# EAGLE design controller (EAGLE 6.1)
DOC_ID: CLK-SCH-03; DOC_PART_NO: CLK-PC-03; DOC_REV: A; DOC_TITLE: MOTHERBOARD; PROJECT_NAME: ALARM CLOCK

## Sheet 1 of 4: CPU
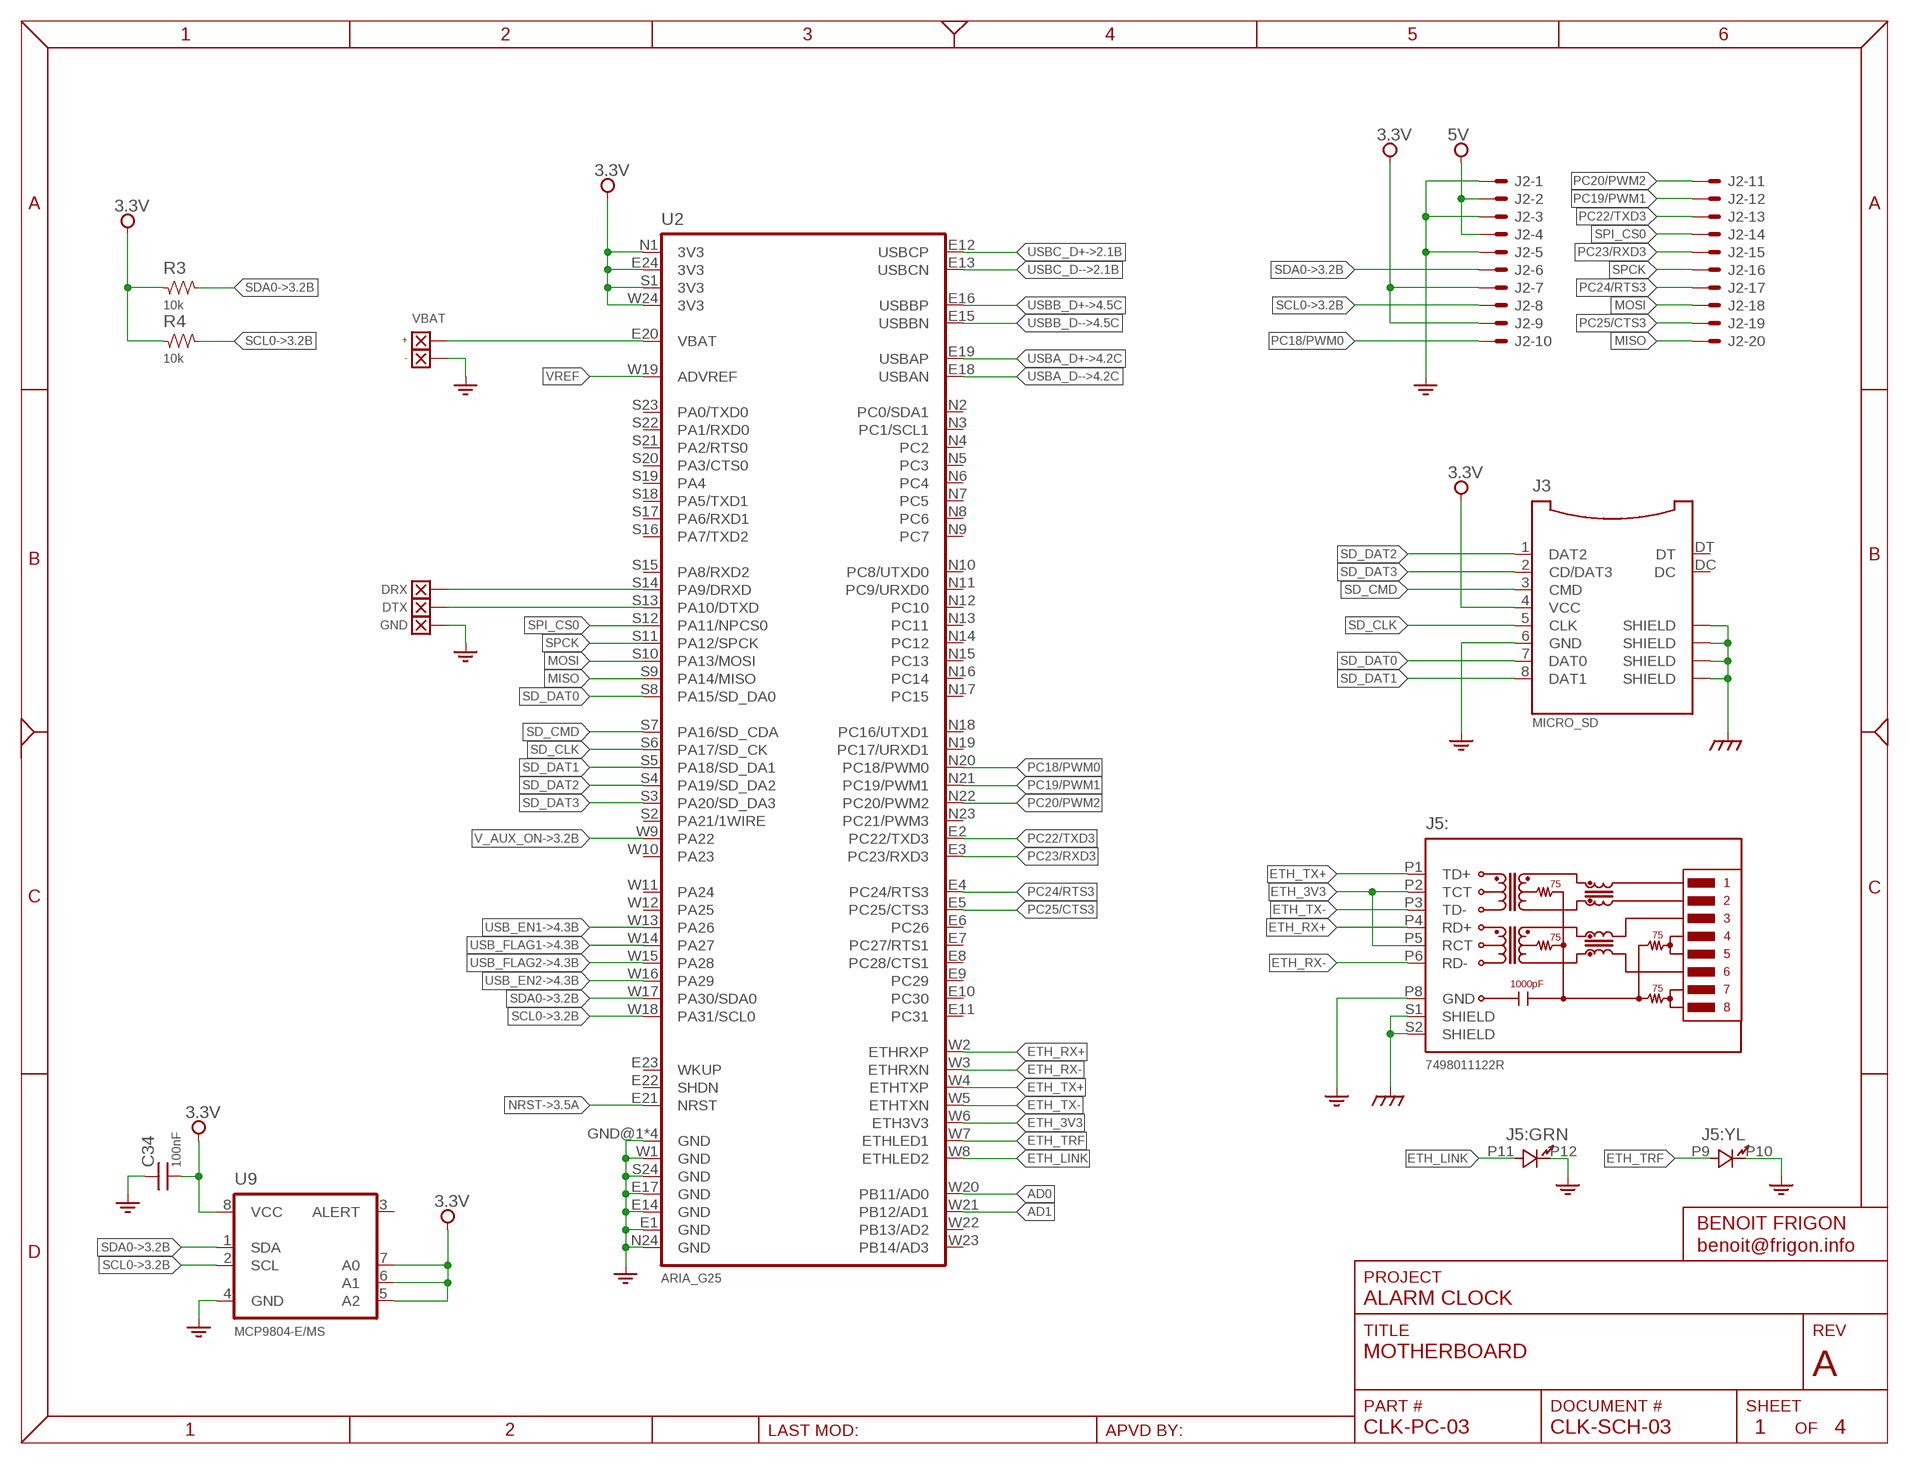
[diagram p0: schematic, sheet 1]

### Parts
C34  100nF  CAP-0603  [SMD_0603]
J2  DL-1.25MM-HEADER-20  [DF13A-20DP-1.25]
J3  MICRO_SD  [5027020891]
J5  7498011122R  [7498011122R]
R3  10k  RES-0603  [SMD_0603]
R4  10k  RES-0603  [SMD_0603]
TP1  +  WIRE-150X75  [WIRE_SMT_150X75]
TP2  -  WIRE-150X75  [WIRE_SMT_150X75]
U2  ARIA_G25  [ARIA_G25]
U9  MCP9804-E/MS  [MSOP8]
W2  DRX  WIRE-150X75  [WIRE_SMT_150X75]
W3  DTX  WIRE-150X75  [WIRE_SMT_150X75]
W4  GND  WIRE-150X75  [WIRE_SMT_150X75]

### Nets
3.3V [Power]: C34.2 J2.7 J2.9 J3.4(VCC) R3.1 R4.1 U2.E24(3V3) U2.N1(3V3) U2.S1(3V3) U2.W24(3V3) U9.5(A2) U9.6(A1) U9.7(A0) U9.8(VCC) ; also sheet 3,4
5V [Power]: J2.2 J2.4 ; also sheet 2,3,4
AD0: U2.W20(PB11/AD0)
AD1: U2.W21(PB12/AD1)
DRX: U2.S14(PA9/DRXD) W2.1
DTX: U2.S13(PA10/DTXD) W3.1
EARTH: J3.SHDL@3(SHIELD) J3.SHLD@1(SHIELD) J3.SHLD@2(SHIELD) J3.SHLD@4(SHIELD) J5.S1(::SHIELD) J5.S2(::SHIELD) ; also sheet 3,4
ETH_3V3: J5.P2(::TCT) J5.P5(::RCT) U2.W6(ETH3V3)
ETH_LINK: J5.P11(:GRN:A) U2.W8(ETHLED2)
ETH_RX+: J5.P4(::RD+) U2.W2(ETHRXP)
ETH_RX-: J5.P6(::RD-) U2.W3(ETHRXN)
ETH_TRF: J5.P9(:YL:A) U2.W7(ETHLED1)
ETH_TX+: J5.P1(::TD+) U2.W4(ETHTXP)
ETH_TX-: J5.P3(::TD-) U2.W5(ETHTXN)
GND [Power]: C34.1 J2.1 J2.3 J2.5 J3.6(GND) J5.P8(::GND) J5.P10(:YL:K) J5.P12(:GRN:K) TP2.1 U2.E1(GND) U2.E14(GND) U2.E17(GND) U2.GND@1(GND) U2.GND@2(GND) U2.GND@3(GND) U2.GND@4(GND) U2.N24(GND) U2.S24(GND) U2.W1(GND) U9.4(GND) W4.1 ; also sheet 2,3,4
MISO: J2.20 U2.S9(PA14/MISO)
MOSI: J2.18 U2.S10(PA13/MOSI)
N$1: TP1.1 U2.E20(VBAT)
NRST: U2.E21(NRST) ; also sheet 3
PC18/PWM0: J2.10 U2.N20(PC18/PWM0)
PC19/PWM1: J2.12 U2.N21(PC19/PWM1)
PC20/PWM2: J2.11 U2.N22(PC20/PWM2)
PC22/TXD3: J2.13 U2.E2(PC22/TXD3)
PC23/RXD3: J2.15 U2.E3(PC23/RXD3)
PC24/RTS3: J2.17 U2.E4(PC24/RTS3)
PC25/CTS3: J2.19 U2.E5(PC25/CTS3)
SCL0: J2.8 R4.2 U2.W18(PA31/SCL0) U9.2(SCL) ; also sheet 3
SD_CLK: J3.5(CLK) U2.S6(PA17/SD_CK)
SD_CMD: J3.3(CMD) U2.S7(PA16/SD_CDA)
SD_DAT0: J3.7(DAT0) U2.S8(PA15/SD_DA0)
SD_DAT1: J3.8(DAT1) U2.S5(PA18/SD_DA1)
SD_DAT2: J3.1(DAT2) U2.S4(PA19/SD_DA2)
SD_DAT3: J3.2(CD/DAT3) U2.S3(PA20/SD_DA3)
SDA0: J2.6 R3.2 U2.W17(PA30/SDA0) U9.1(SDA) ; also sheet 3
SPCK: J2.16 U2.S11(PA12/SPCK)
SPI_CS0: J2.14 U2.S12(PA11/NPCS0)
USB_EN1: U2.W13(PA26) ; also sheet 4
USB_EN2: U2.W16(PA29) ; also sheet 4
USB_FLAG1: U2.W14(PA27) ; also sheet 4
USB_FLAG2: U2.W15(PA28) ; also sheet 4
USBA_D+: U2.E19(USBAP) ; also sheet 4
USBA_D-: U2.E18(USBAN) ; also sheet 4
USBB_D+: U2.E16(USBBP) ; also sheet 4
USBB_D-: U2.E15(USBBN) ; also sheet 4
USBC_D+: U2.E12(USBCP) ; also sheet 2
USBC_D-: U2.E13(USBCN) ; also sheet 2
V_AUX_ON: U2.W9(PA22) ; also sheet 3
VREF: U2.W19(ADVREF)
Unconnected: J3.DC J3.DT U2.E6(PC26) U2.E7(PC27/RTS1) U2.E8(PC28/CTS1) U2.E9(PC29) U2.E10(PC30) U2.E11(PC31) U2.E22(SHDN) U2.E23(WKUP) U2.N2(PC0/SDA1) U2.N3(PC1/SCL1) U2.N4(PC2) U2.N5(PC3) U2.N6(PC4) U2.N7(PC5) U2.N8(PC6) U2.N9(PC7) U2.N10(PC8/UTXD0) U2.N11(PC9/URXD0) U2.N12(PC10) U2.N13(PC11) U2.N14(PC12) U2.N15(PC13) U2.N16(PC14) U2.N17(PC15) U2.N18(PC16/UTXD1) U2.N19(PC17/URXD1) U2.N23(PC21/PWM3) U2.S2(PA21/1WIRE) U2.S15(PA8/RXD2) U2.S16(PA7/TXD2) U2.S17(PA6/RXD1) U2.S18(PA5/TXD1) U2.S19(PA4) U2.S20(PA3/CTS0) U2.S21(PA2/RTS0) U2.S22(PA1/RXD0) U2.S23(PA0/TXD0) U2.W10(PA23) U2.W11(PA24) U2.W12(PA25) U2.W22(PB13/AD2) U2.W23(PB14/AD3) U9.3(ALERT)

### Notes on the sheet
- VBAT

## Sheet 2 of 4: Audio
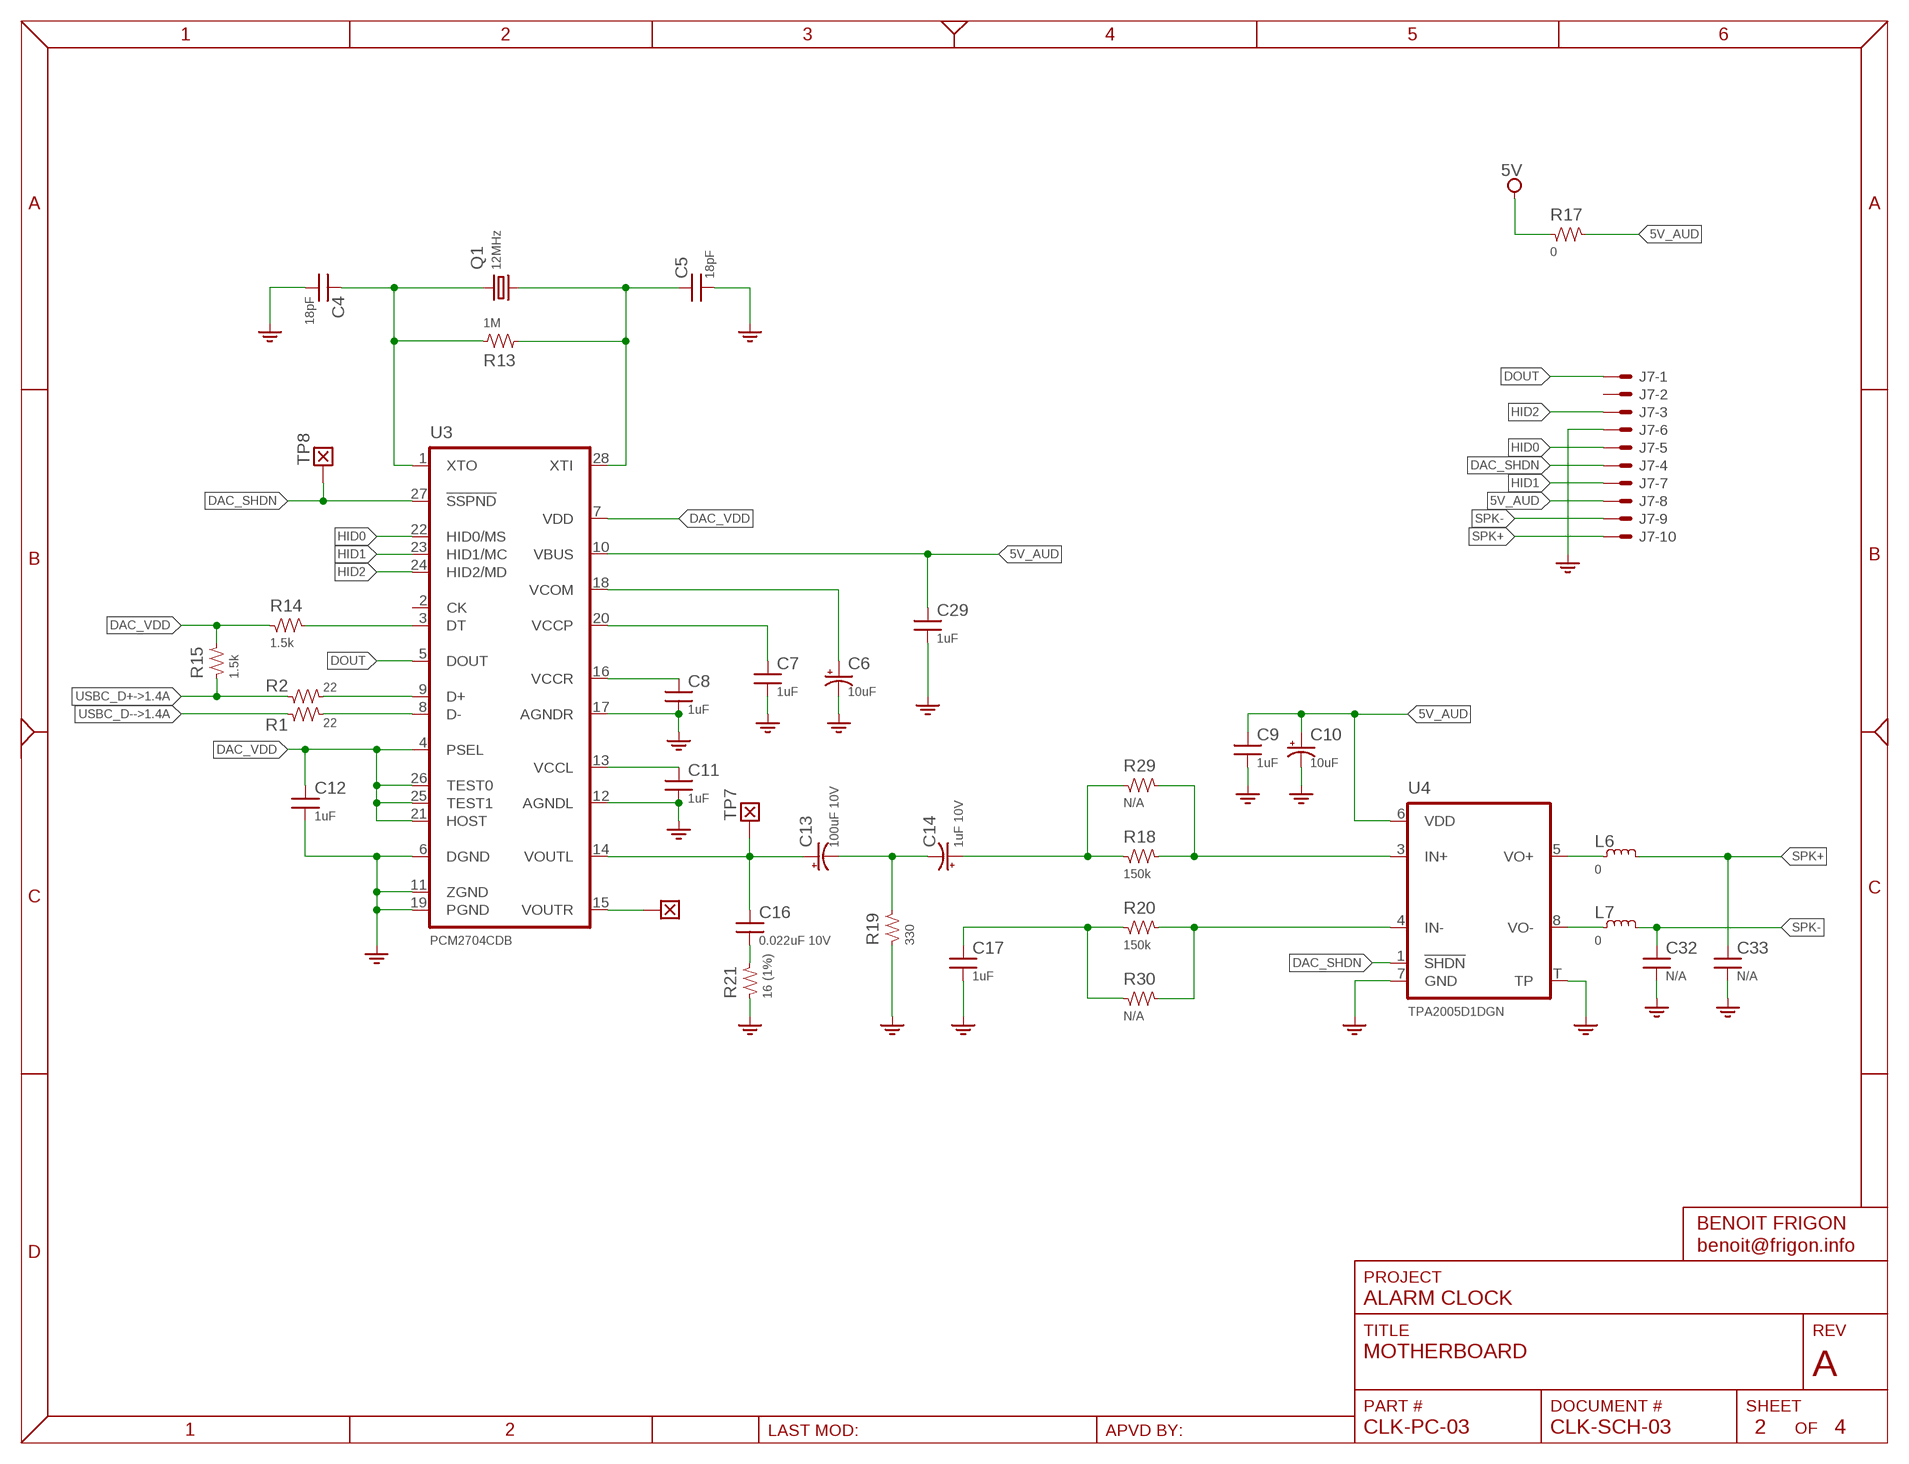
[diagram p1: schematic, sheet 2]
FRAME2 (FRAME_LETTER): SUBTITLE: AUDIO

### Parts
C4  18pF  CAP-0603  [SMD_0603]
C5  18pF  CAP-0603  [SMD_0603]
C6  10uF  CAP-E-0805-ALUM  [CAP_S0805]
C7  1uF  CAP-0603  [SMD_0603]
C8  1uF  CAP-0603  [SMD_0603]
C9  1uF  CAP-0603  [SMD_0603]
C10  10uF  CAP-E-0805-ALUM  [CAP_S0805]
C11  1uF  CAP-0603  [SMD_0603]
C12  1uF  CAP-0603  [SMD_0603]
C13  100uF 10V  CAP-E-1210-ALUM  [CAP_S1210]
C14  1uF 10V  CAP-E-0805-ALUM  [CAP_S0805]
C16  0.022uF 10V  CAP-0603  [SMD_0603]
C17  1uF  CAP-0603  [SMD_0603]
C29  1uF  CAP-0603  [SMD_0603]
C32  N/A  CAP-0603  [SMD_0603]
C33  N/A  CAP-0603  [SMD_0603]
J7  DL-1.25MM-HEADER-10  [DF13A-10DP-1.25]
L6  0  IND-0603  [SMD_0603]
L7  0  IND-0603  [SMD_0603]
Q1  12MHz  XTALHC49UP  [HC49UP]
R1  22  RES-0603  [SMD_0603]
R2  22  RES-0603  [SMD_0603]
R13  1M  RES-0603  [SMD_0603]
R14  1.5k  RES-0603  [SMD_0603]
R15  1.5k  RES-0603  [SMD_0603]
R17  0  RES-1206  [SMD_1206]
R18  150k  RES-0603  [SMD_0603]
R19  330  RES-0603  [SMD_0603]
R20  150k  RES-0603  [SMD_0603]
R21  16 (1%)  RES-0603  [SMD_0603]
R29  N/A  RES-0603  [SMD_0603]
R30  N/A  RES-0603  [SMD_0603]
TP7  TEST_POINT-050  [TP_050]
TP8  TEST_POINT-050  [TP_050]
U3  PCM2704CDB  [SSOP28]
U4  TPA2005D1DGN  [PPSOP8]
W1  WIRE-150X75  [WIRE_SMT_150X75]

### Nets
5V [Power]: R17.1 ; also sheet 1,3,4
5V_AUD [Power]: C9.1 C10.+ C29.1 J7.8 R17.2 U3.10(VBUS) U4.6(VDD)
DAC_SHDN: J7.4 TP8.1 U3.27(!SSPND) U4.1(!SHDN)
DAC_VDD: C12.1 R14.1 R15.2 U3.4(PSEL) U3.7(VDD) U3.21(HOST) U3.25(TEST1) U3.26(TEST0)
DOUT: J7.1 U3.5(DOUT)
GND [Power]: C4.2 C5.2 C6.- C7.2 C8.2 C9.2 C10.- C11.2 C12.2 C17.2 C29.2 C32.2 C33.2 J7.6 R19.1 R21.1 U3.6(DGND) U3.11(ZGND) U3.12(AGNDL) U3.17(AGNDR) U3.19(PGND) U4.7(GND) U4.T(TP) ; also sheet 1,3,4
HID0: J7.5 U3.22(HID0/MS)
HID1: J7.7 U3.23(HID1/MC)
HID2: J7.3 U3.24(HID2/MD)
N$12: R2.2 U3.9(D+)
N$13: R1.2 U3.8(D-)
N$14: C11.1 U3.13(VCCL)
N$15: C6.+ U3.18(VCOM)
N$16: C7.1 U3.20(VCCP)
N$17: C8.1 U3.16(VCCR)
N$18: C14.+ R18.1 R29.1
N$19: R14.2 U3.3(DT)
N$20: U3.15(VOUTR) W1.1
N$24: L6.1 U4.5(VO+)
N$25: L7.1 U4.8(VO-)
N$26: R18.2 R29.2 U4.3(IN+)
N$27: R20.2 R30.2 U4.4(IN-)
N$28: C17.1 R20.1 R30.1
N$29: C13.- C14.- R19.2
N$31: C16.2 R21.2
SPK+: C33.1 J7.10 L6.2
SPK-: C32.1 J7.9 L7.2
USBC_D+: R2.1 R15.1 ; also sheet 1
USBC_D-: R1.1 ; also sheet 1
VOUTL: C13.+ C16.1 TP7.1 U3.14(VOUTL)
XTI: C5.1 Q1.2 R13.2 U3.28(XTI)
XTO: C4.1 Q1.1 R13.1 U3.1(XTO)
Unconnected: J7.2 U3.2(CK)

## Sheet 3 of 4: Power supply
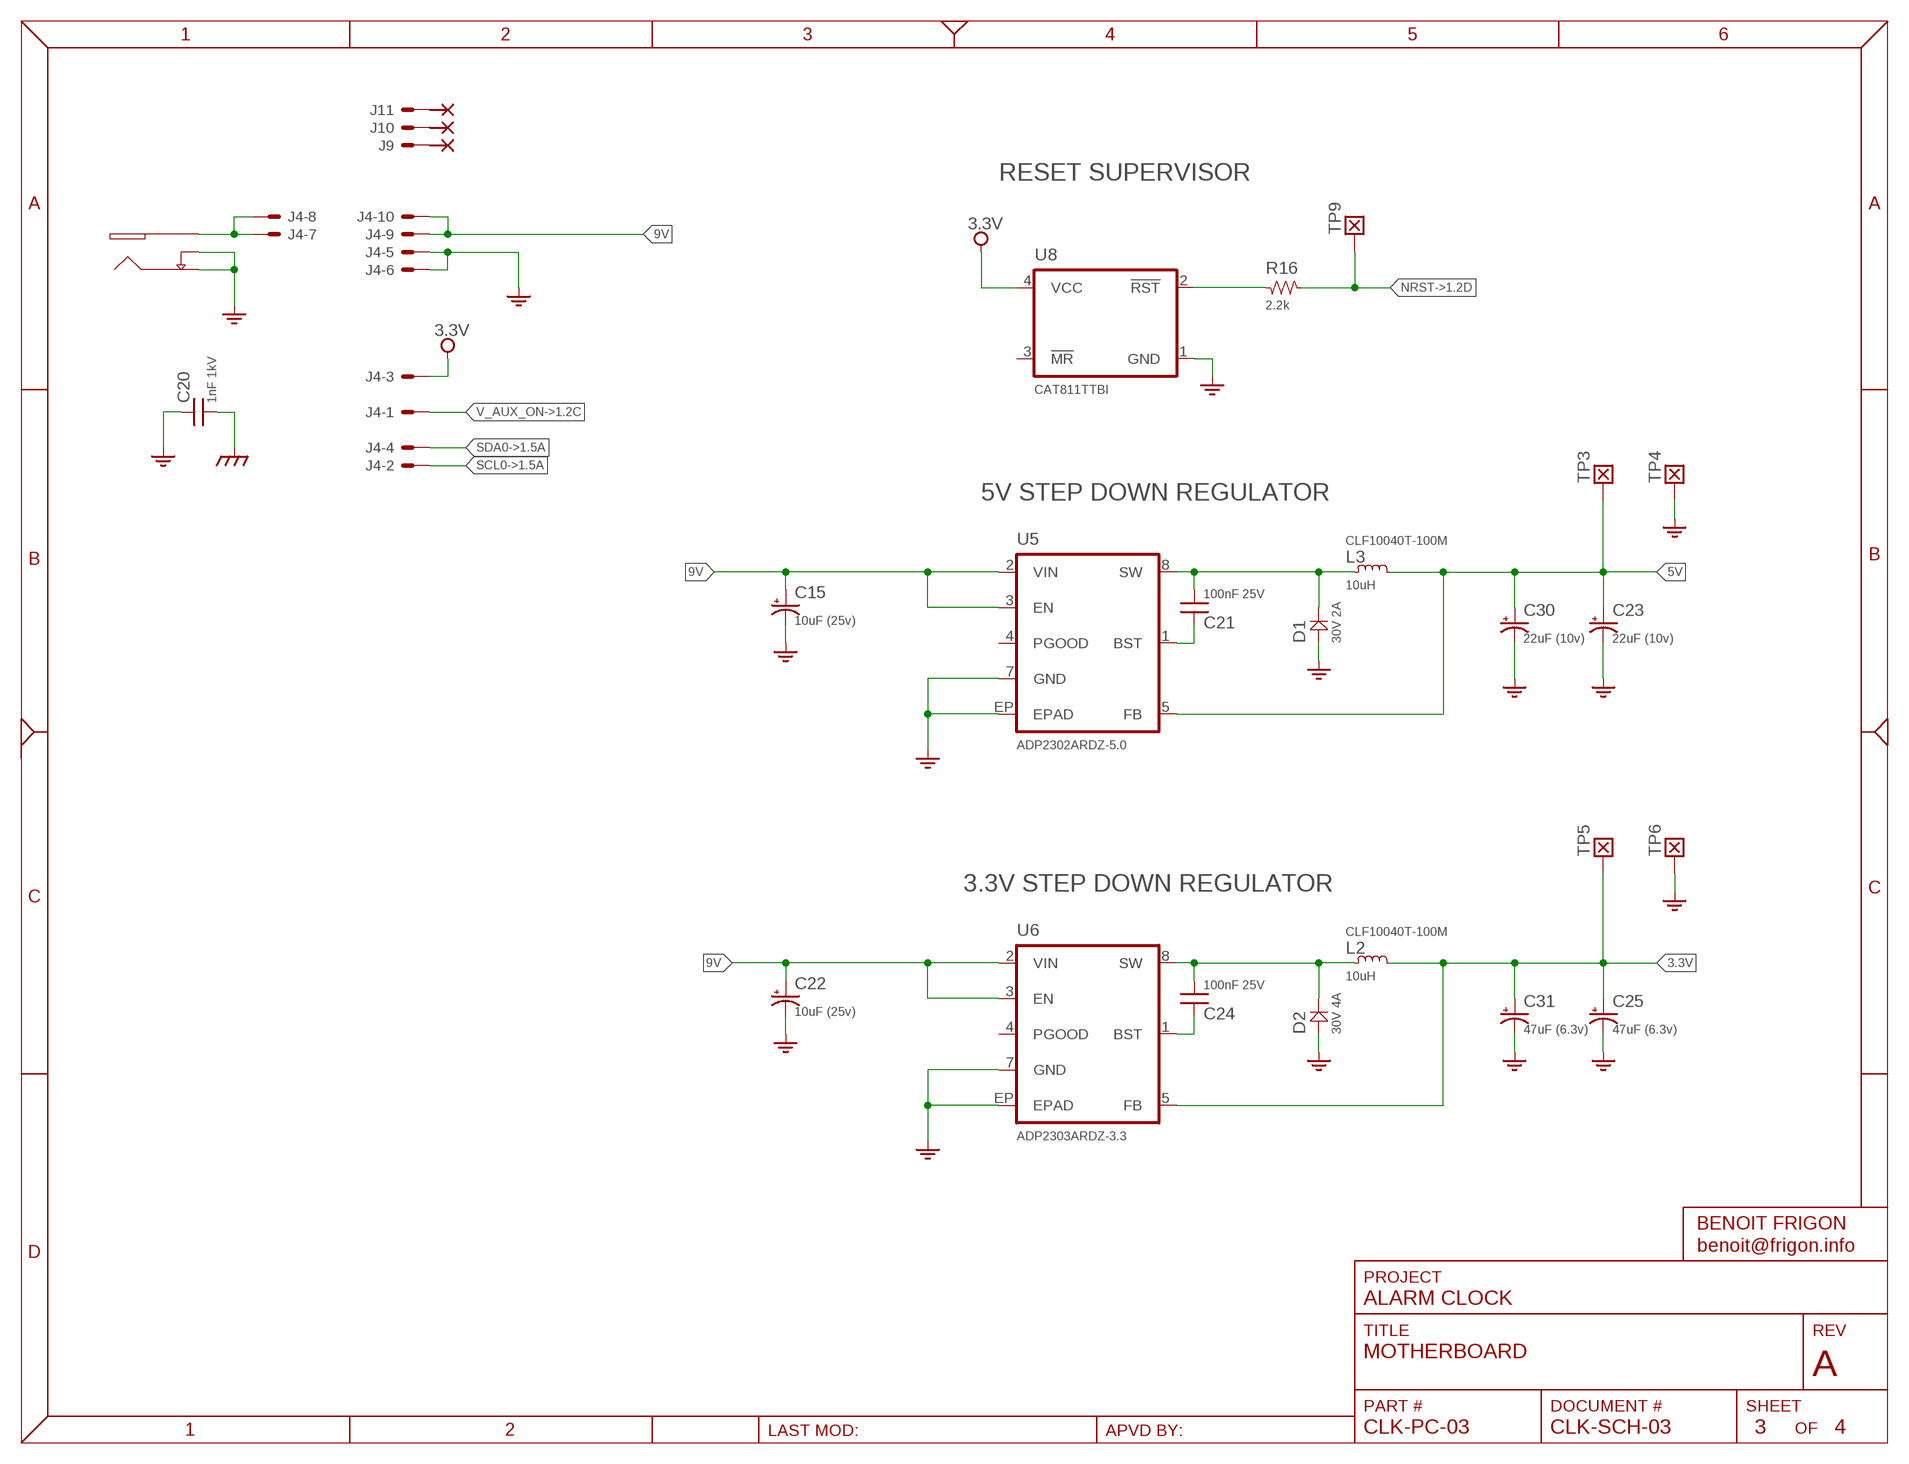
[diagram p2: schematic, sheet 3]
FRAME3 (FRAME_LETTER): SUBTITLE: POWER SUPPLY

### Parts
C15  10uF (25v)  CAP-E-1210-TANT  [CAP_S1210]
C20  1nF 1kV  CAP-0805  [SMD_0805]
C21  100nF 25V  CAP-0603  [SMD_0603]
C22  10uF (25v)  CAP-E-1210-TANT  [CAP_S1210]
C23  22uF (10v)  CAP-E-1206-TANT  [CAP_S1206]
C24  100nF 25V  CAP-0603  [SMD_0603]
C25  47uF (6.3v)  CAP-E-1206-TANT  [CAP_S1206]
C30  22uF (10v)  CAP-E-1206-TANT  [CAP_S1206]
C31  47uF (6.3v)  CAP-E-1206-TANT  [CAP_S1206]
D1  30V 2A  DIODE-DO214-AA  [DIODE_DO214-AA]
D2  30V 4A  DIODE-DO214-AA  [DIODE_DO214-AA]
J4  DL-100-HEADER-10-V  [534206-5]
J8  CUI-PJ-013C  [CUI-PJ-013C]
J9  SNG-100-HEADER-01-HDR-V  [HDR_M_1]
J10  SNG-100-HEADER-01-HDR-V  [HDR_M_1]
J11  SNG-100-HEADER-01-HDR-V  [HDR_M_1]
L2  10uH  IND-10X10  [IND-10X10]
L3  10uH  IND-10X10  [IND-10X10]
R16  2.2k  RES-0603  [SMD_0603]
TP3  TEST_POINT-050  [TP_050]
TP4  TEST_POINT-050  [TP_050]
TP5  TEST_POINT-050  [TP_050]
TP6  TEST_POINT-050  [TP_050]
TP9  TEST_POINT-050  [TP_050]
U5  ADP2302ARDZ-5.0  [SOIC8-EP]
U6  ADP2303ARDZ-3.3  [SOIC8-EP]
U8  CAT811TTBI  [SOT143]

### Nets
3.3V [Power]: C25.+ C31.+ J4.3 L2.2 TP5.1 U6.5(FB) U8.4(VCC) ; also sheet 1,4
5V [Power]: C23.+ C30.+ L3.2 TP3.1 U5.5(FB) ; also sheet 1,2,4
9V [Power]: C15.+ C22.+ J4.9 J4.10 U5.2(VIN) U5.3(EN) U6.2(VIN) U6.3(EN)
BST_3.3V: C24.1 U6.1(BST)
BST_5V: C21.1 U5.1(BST)
EARTH: C20.2 ; also sheet 1,4
GND [Power]: C15.- C20.1 C22.- C23.- C25.- C30.- C31.- D1.A D2.A J4.5 J4.6 J8.2(GND) J8.3(SW) TP4.1 TP6.1 U5.7(GND) U5.EP(EPAD) U6.7(GND) U6.EP(EPAD) U8.1(GND) ; also sheet 1,2,4
N$21: R16.1 U8.2(!RST)
N$23: J4.7 J4.8 J8.1(V+)
NRST: R16.2 TP9.1 ; also sheet 1
SCL0: J4.2 ; also sheet 1
SDA0: J4.4 ; also sheet 1
SW_3.3: C24.2 D2.K L2.1 U6.8(SW)
SW_5V: C21.2 D1.K L3.1 U5.8(SW)
V_AUX_ON: J4.1 ; also sheet 1
Unconnected: J9.1(S) J10.1(S) J11.1(S) U5.4(PGOOD) U6.4(PGOOD) U8.3(!MR)

### Notes on the sheet
- RESET SUPERVISOR
- 5V STEP DOWN REGULATOR
- 3.3V STEP DOWN REGULATOR

## Sheet 4 of 4: USB
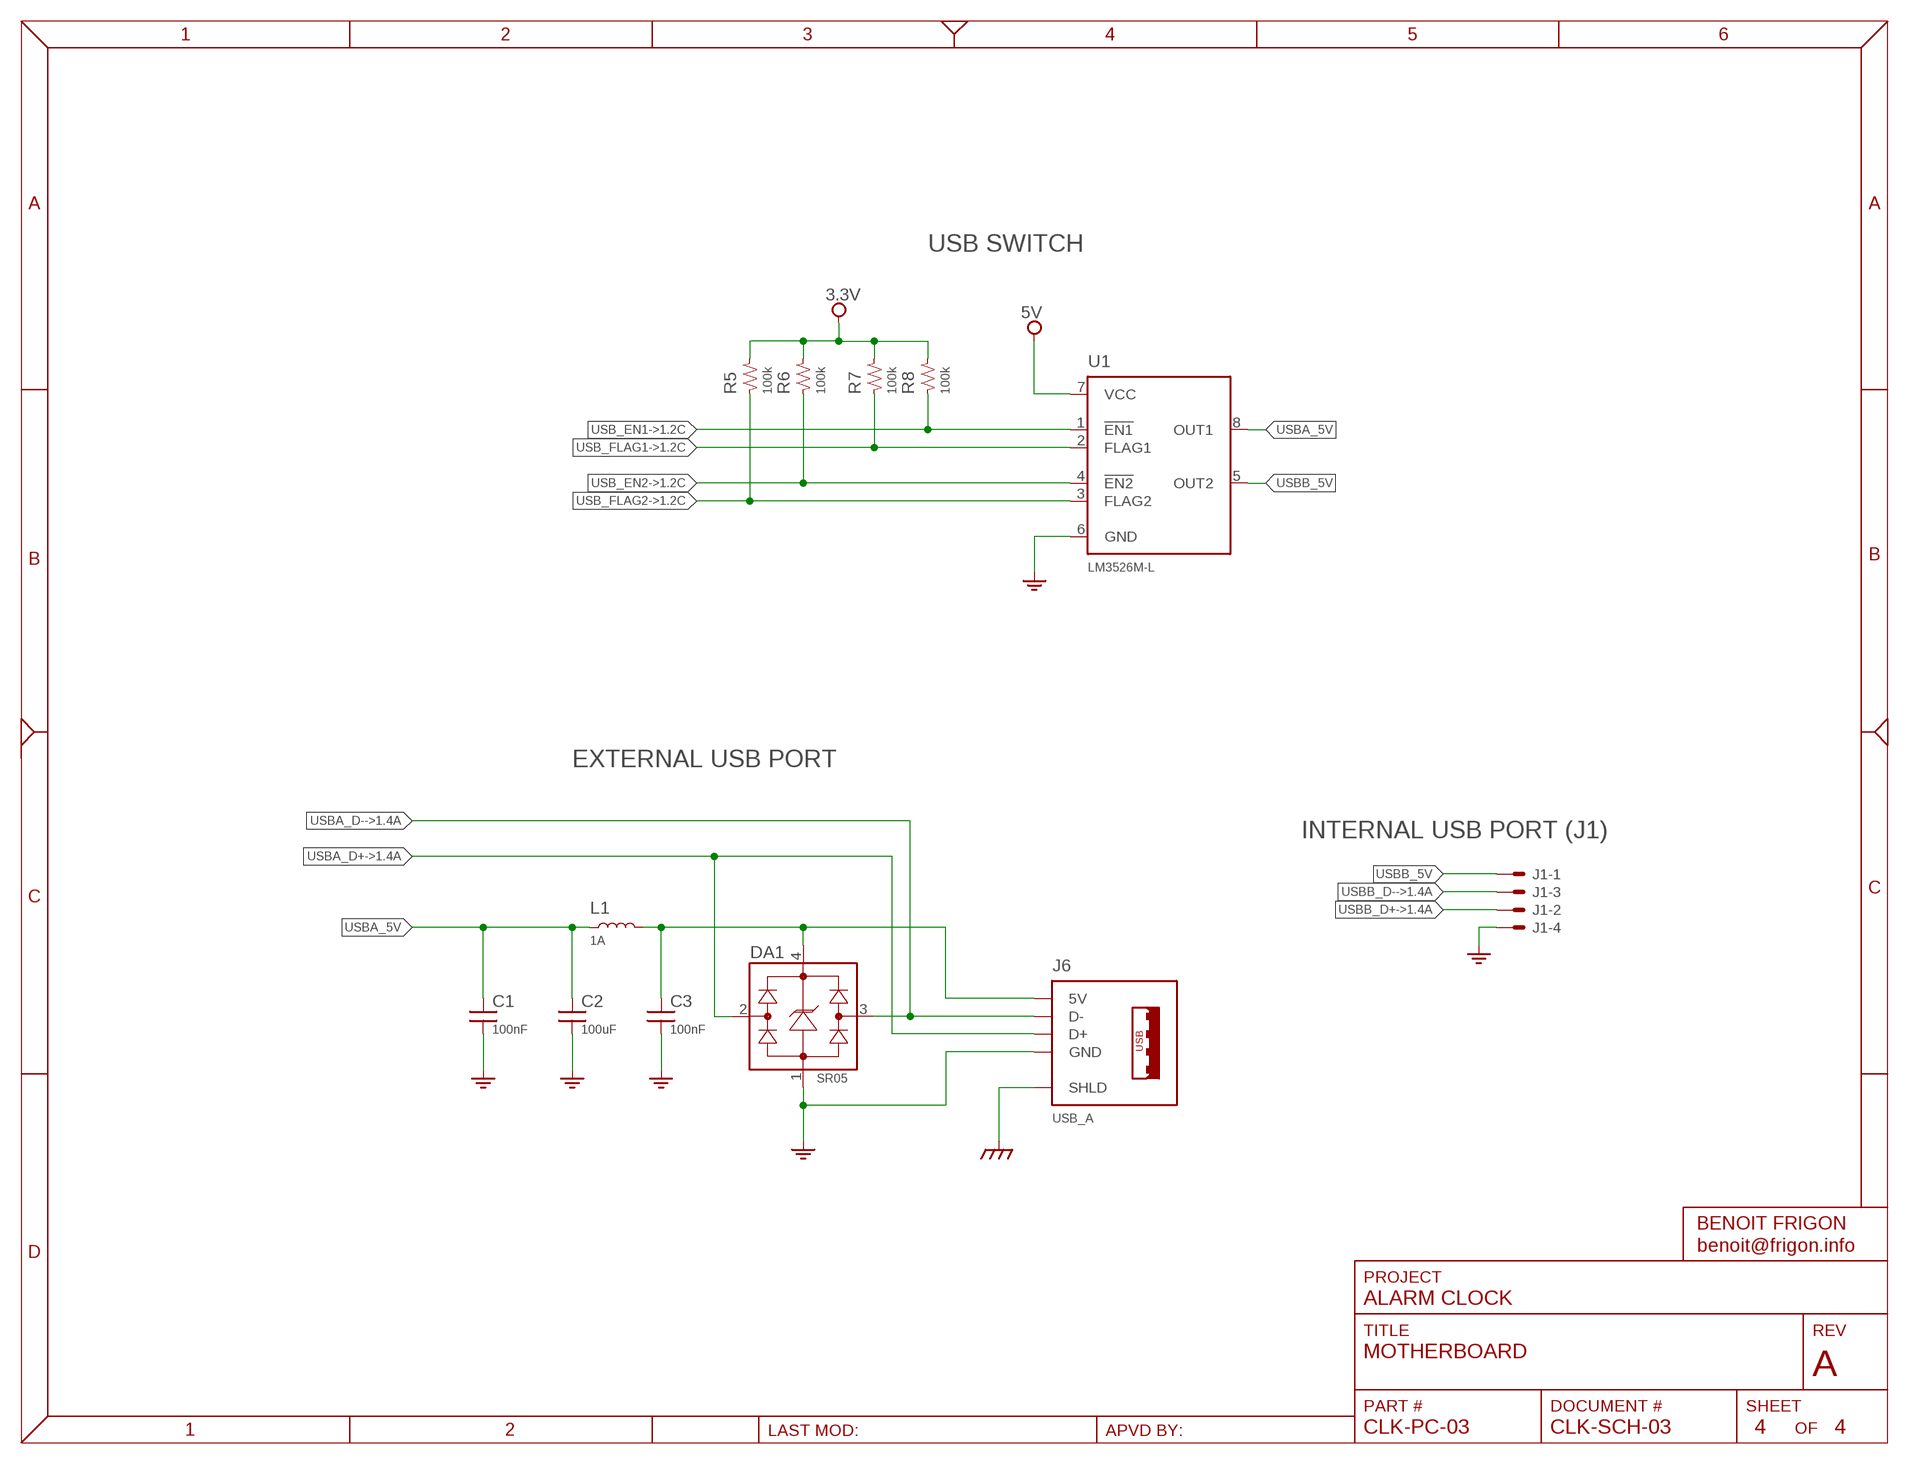
[diagram p3: schematic, sheet 4]

### Parts
C1  100nF  CAP-0603  [SMD_0603]
C2  100uF  CAP-0805  [SMD_0805]
C3  100nF  CAP-0603  [SMD_0603]
DA1  SR05  [SOT143]
J1  SNG-2MM-HEADER-04-V  [DF3X-4P-2DSA]
J6  USB_A  [292303-1]
L1  1A  FERRITE  [SMD_0805]
R5  100k  RES-0603  [SMD_0603]
R6  100k  RES-0603  [SMD_0603]
R7  100k  RES-0603  [SMD_0603]
R8  100k  RES-0603  [SMD_0603]
U1  LM3526M-L  [SOIC8]

### Nets
3.3V [Power]: R5.2 R6.2 R7.2 R8.2 ; also sheet 1,3
5V [Power]: U1.7(VCC) ; also sheet 1,2,3
EARTH: J6.SHLD@1(SHLD) J6.SHLD@2(SHLD) ; also sheet 1,3
GND [Power]: C1.2 C2.2 C3.2 DA1.1 J1.4 J6.4(GND) U1.6(GND) ; also sheet 1,2,3
N$5: C3.1 DA1.4 J6.1(5V) L1.2
USB_EN1: R8.1 U1.1(!EN1) ; also sheet 1
USB_EN2: R6.1 U1.4(!EN2) ; also sheet 1
USB_FLAG1: R7.1 U1.2(FLAG1) ; also sheet 1
USB_FLAG2: R5.1 U1.3(FLAG2) ; also sheet 1
USBA_5V: C1.1 C2.1 L1.1 U1.8(OUT1)
USBA_D+: DA1.2 J6.3(D+) ; also sheet 1
USBA_D-: DA1.3 J6.2(D-) ; also sheet 1
USBB_5V: J1.1 U1.5(OUT2)
USBB_D+: J1.2 ; also sheet 1
USBB_D-: J1.3 ; also sheet 1

### Notes on the sheet
- USB SWITCH
- EXTERNAL USB PORT
- INTERNAL USB PORT (J1)

## Library data of the parts
C1 C3-C5 C7-C9 C11 C12 C16 C17 C21 C24 C29 C32-C34 = Passive:CAP: Capacitor; DESCRIPTION: {DESCRIPTION} - SMT 0603 - {value}; PACKAGE: SMT 0603
C2 C20 = Passive:CAP: Capacitor; DESCRIPTION: {DESCRIPTION} - SMT 0805 - {value}; PACKAGE: SMT 0805
C6 C10 C14 = Passive:CAP-E-?-*: Capacitor; DESCRIPTION: Aluminium capacitor - SMT 0805 - {VALUE}
C13 = Passive:CAP-E-?-*: Capacitor; DESCRIPTION: Aluminium capacitor - SMT 1210 - {VALUE}; MFG: AVX
C15 C22 = Passive:CAP-E-?-*: Capacitor; DESCRIPTION: Tantalum capacitor - SMT 1210 - {VALUE}; MFG: AVX; PART_NO: TPSB106K025R1800
C23 C30 = Passive:CAP-E-?-*: Capacitor; DESCRIPTION: Tantalum capacitor - SMT 1206 - {VALUE}; MFG: AVX; PART_NO: TPSA226M010R0900
C25 C31 = Passive:CAP-E-?-*: Capacitor; DESCRIPTION: Tantalum capacitor - SMT 1206 - {VALUE}; MFG: AVX; PART_NO: TPSA476K006R0800
D1 D2 = Passive:DIODE: Diode
DA1 = Passive:SR05: TVS Array 2-Line - 5V; MFG: Semtech; SKU: SR05.TCT
J1 = Connectors:SNG-2MM-HEADER-04: 2mm Single Row Header - 4 pos; DESCRIPTION: {DESCRIPTION} - Vertical; MFG: Hirose Electronic; SKU: DF3A-4P-2DSA
J2 = Connectors:DL-1.25MM-HEADER-20
J3 = Connectors:MICRO_SD
J4 = Connectors:DL-100-HEADER-10: 10 Pos - Dual Row - 2.54mm; DESCRIPTION: {DESCRIPTION} Receptacle - Vertical; MFG: Tyco Electronics; SKU: 534206-5
J5 = Connectors:7498011122R
J6 = Connectors:USB_A
J7 = Connectors:DL-1.25MM-HEADER-10
J8 = Connectors:CUI-PJ-013C
J9-J11 = Connectors:SNG-100-HEADER-01: 1 Pos - 2.54mm header
L1 = Passive:FERRITE: Ferrite; DESCRIPTION: {DESCRIPTION} - SMT 0805 - {VALUE}
L2 = Passive:IND?*: Inductor; DESCRIPTION: {DESCRIPTION} - SMT 10x10mm - {VALUE}; PART_NO: CLF10040T-100M
L3 = Passive:IND?*: Inductor; DESCRIPTION: {DESCRIPTION} - SMT 10x10mm - {VALUE}; MFG: TDK; PART_NO: CLF10040T-100M
L6 L7 = Passive:IND?*: Inductor; DESCRIPTION: {DESCRIPTION} - SMT 0603 - {VALUE}
Q1 = Crystal:XTAL: Crystal
R1-R8 R13-R16 R18-R21 R29 R30 = Passive:RES: Resistor; DESCRIPTION: {DESCRIPTION} - SMT 0603 - {VALUE}; PACKAGE: SMT 0603
R17 = Passive:RES: Resistor; DESCRIPTION: {DESCRIPTION} - SMT 1206 - {VALUE}; PACKAGE: SMT 1206
TP1 TP2 W1-W4 = Misc:WIRE-?: Wire solder pad; BOM: FALSE
TP3-TP9 = Misc:TEST_POINT; BOM: FALSE
U1 = Power:LM3526?-*: Dual Port USB Power Switch and Over-Current Protection Features Compatible with USB1.1 and USB 2.0 1 ms fault flag delay filters Hot-Plug events Smooth turn-on eliminates in-rush induced voltage drop UL recognized component: REF# 205202 1A nominal short circuit output current protects PC power supplies Thermal shutdown protects device in direct short condition 500mA minimum continuous load current Small SO-8 package minimizes board space 2.7V to 5.5V input voltage range 140 m? Max. switch resistance 1 ?A Max. standby current 200 ?A Max. operating current Under-voltage lockout (UVLO); DESCRIPTION: Dual Port USB Power Switch and Over-Current Protection (Active Low); MFG: National Semiconductors
U2 = IC:ARIA_G25: ARM SoM 400MHz
U3 = IC:PCM2704C
U4 = IC:TPA2005D1?
U5 = Power:ADP230?: Step-Down Regulator; DESCRIPTION: {DESCRIPTION} - 2A, 5V; MFG: Analog Devices
U6 = Power:ADP230?: Step-Down Regulator; DESCRIPTION: {DESCRIPTION} - 3A, 3.3v; MFG: Analog Devices
U8 = IC:CAT811*?: Microprocessor power supply supervisor; DESCRIPTION: {DESCRIPTION} - 3.08V threshold; MFG: ON Semiconductors; THRESHOLD: 3.08V
U9 = IC:MCP9804-*/?: ±0.25°C Typical Accuracy Digital Temperature Sensor; MFG: Microchip

## Net classes
1 Power: width 0.305 mm, drill 0.508 mm

## Board
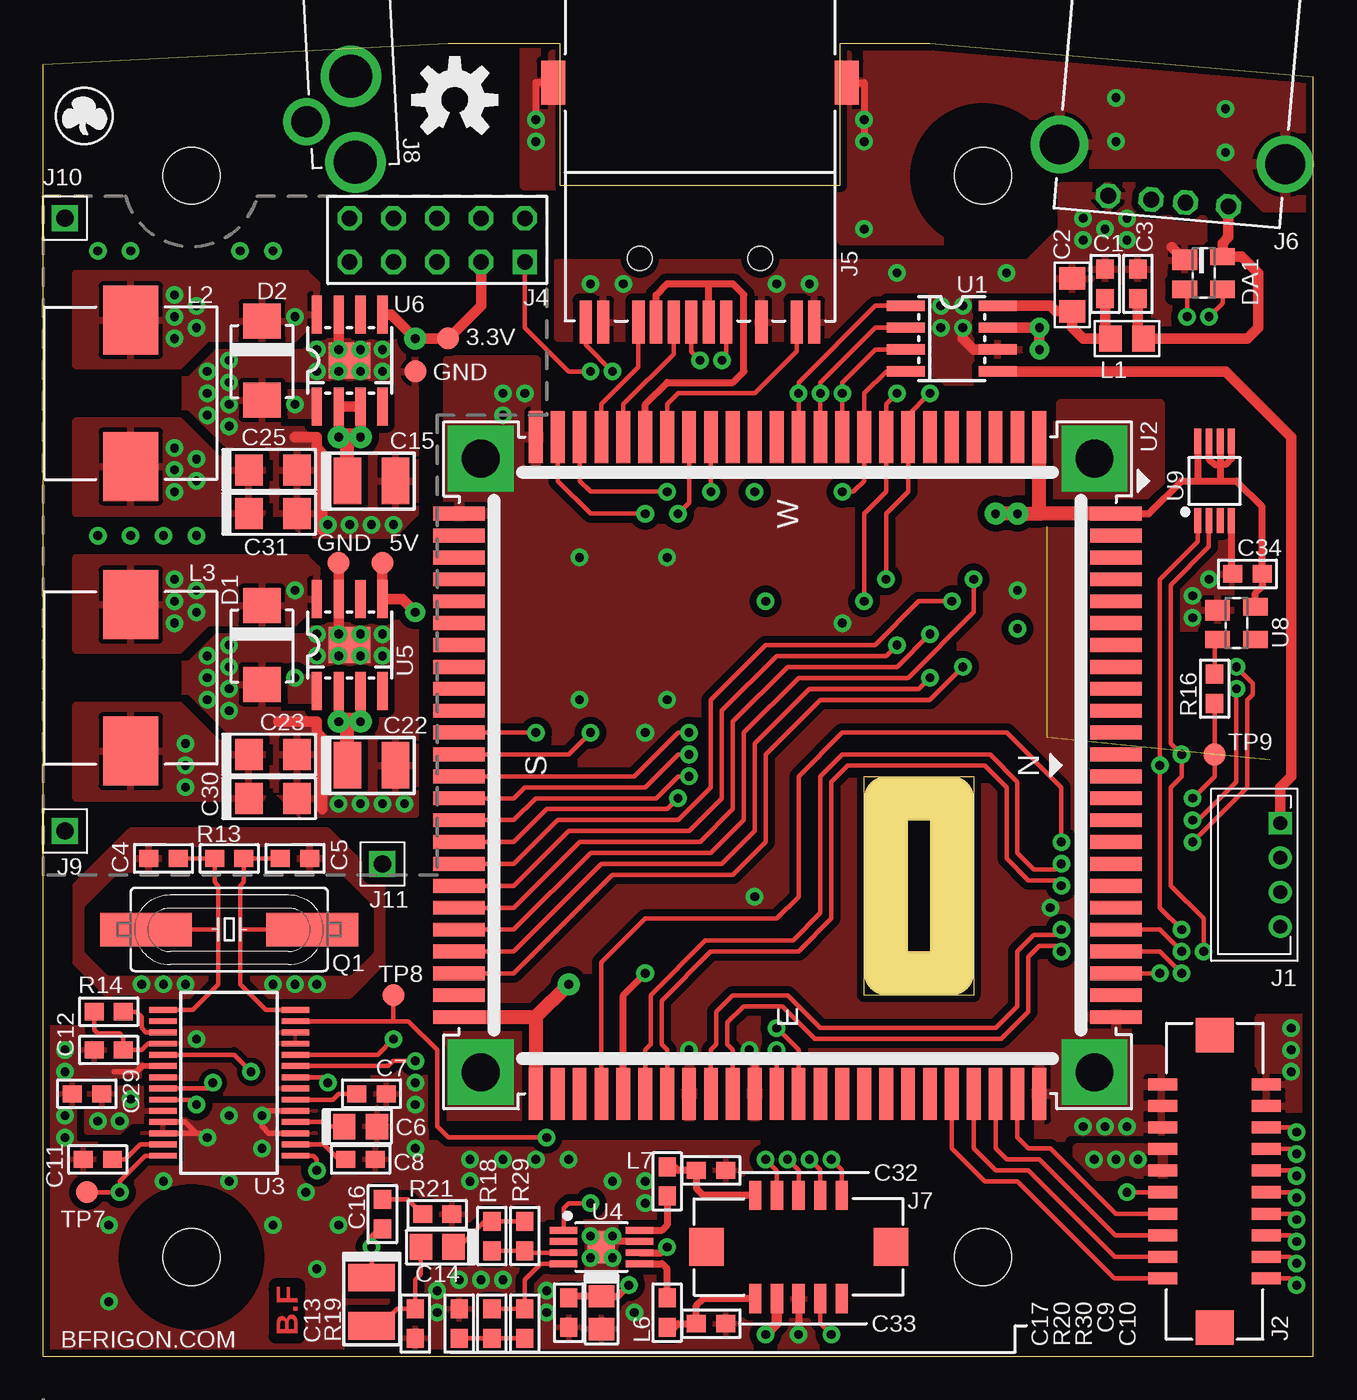
[diagram p4: board, top side]
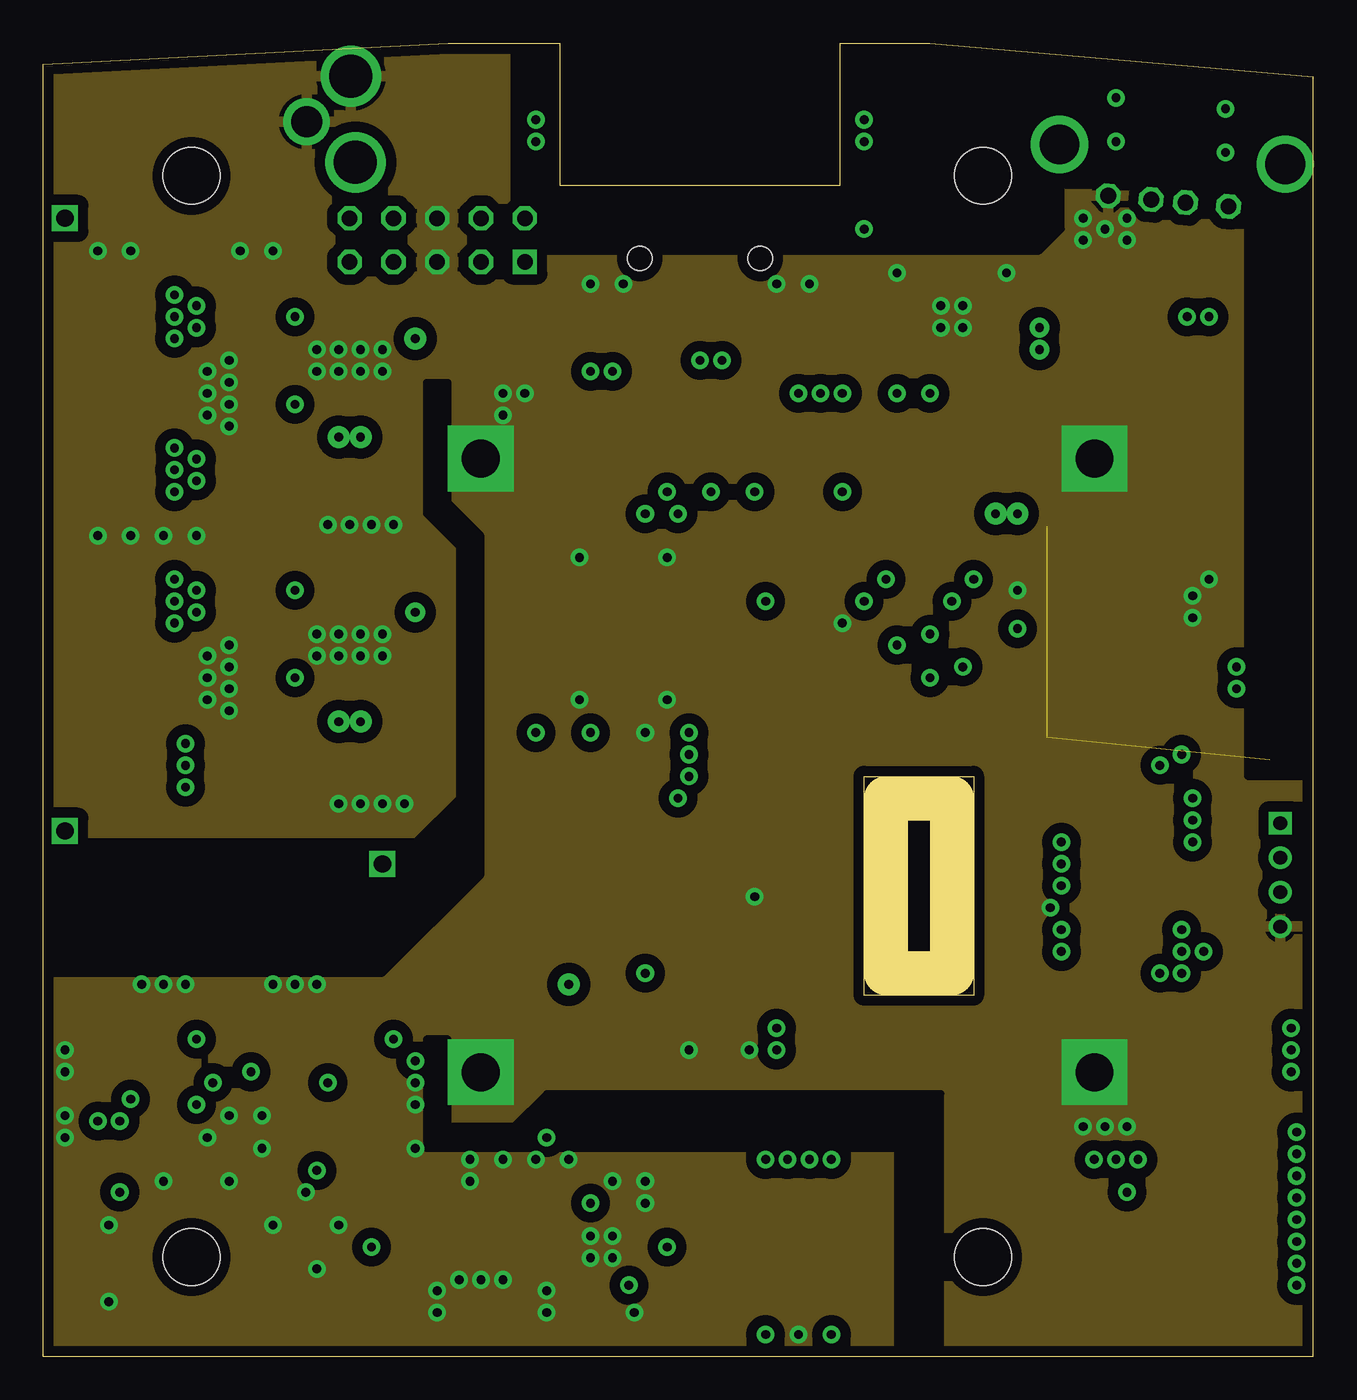
[diagram p5: board, inner layer GND]
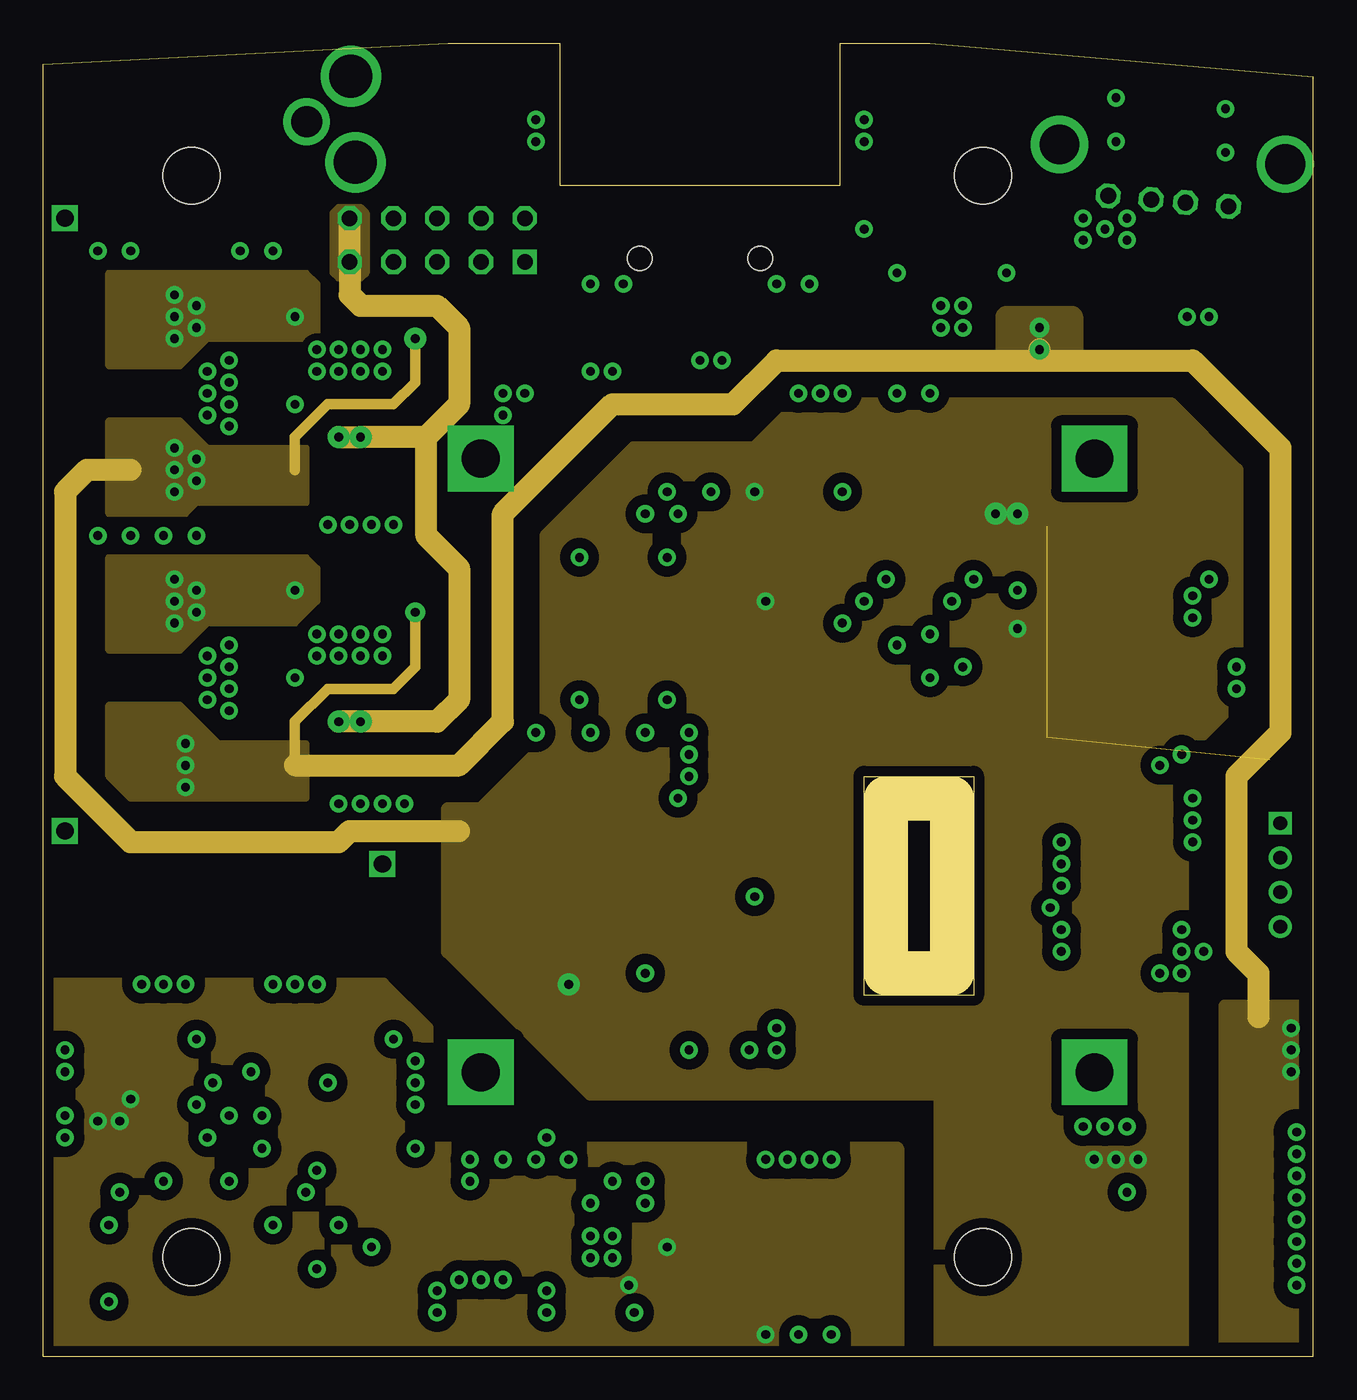
[diagram p6: board, inner layer Power]
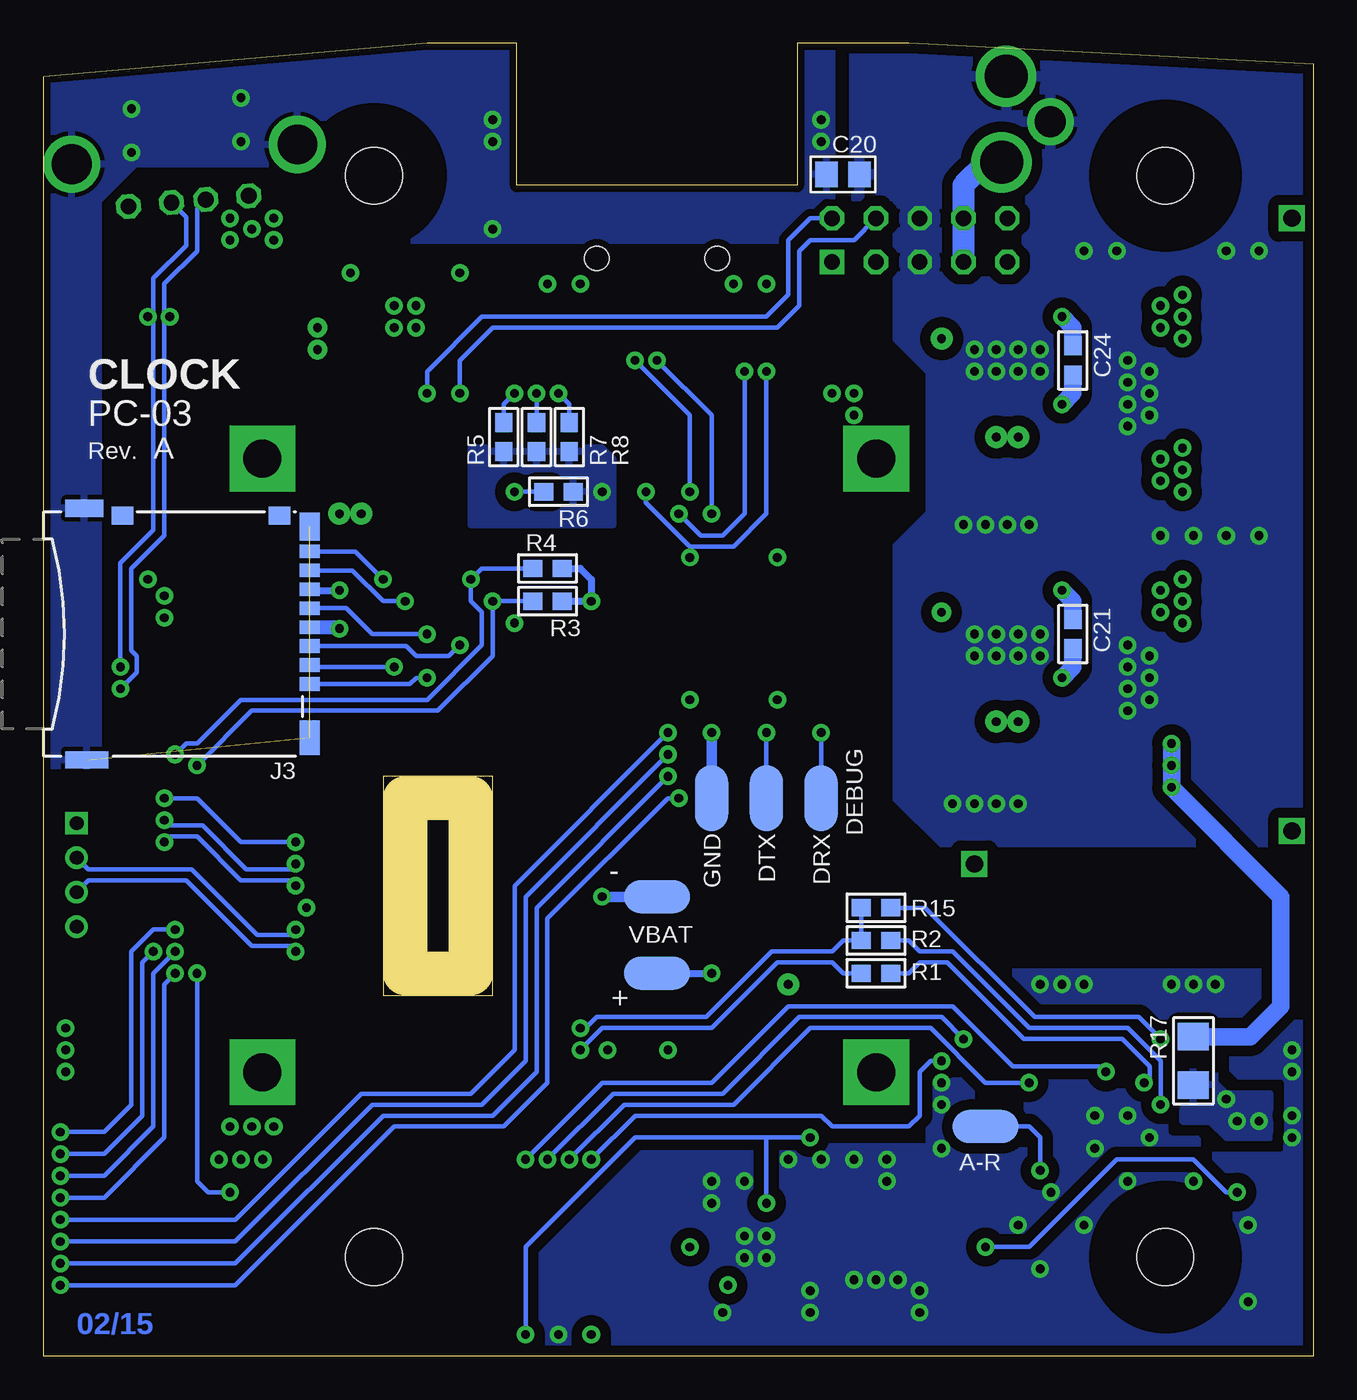
[diagram p7: board, bottom side, seen from below]

Size 73.66 x 76.2 mm. Coordinates in mm from the lower left corner, seen from the top.
Outline: 0,0 73.66,0 73.66,74.24 51.44,76.2 46.23,76.2 46.23,67.94 29.97,67.94 29.97,76.2 23.5,76.2 0,74.98 0,0
Copper layers (1*2+3*16): Top 0.035mm / dielectric 1.5mm / GND 0.0175mm / dielectric 1.1mm / Power 0.035mm / dielectric 0.2mm / Bottom 0.035mm
Design rules: minimum track width 8mil, minimum drill 18mil, track to track 8mil, track to pad 8mil, pad to pad 8mil, via to via 8mil, smd to smd 0mil, copper to edge 10mil, drill to drill 10mil, minimum pad ring 10mil, minimum via ring 10mil, stop-mask expansion 2mil, vias tented up to drill 25mil, thermal gap 10mil
Holes 3.28 mm at 8.61,5.77 54.51,5.77 54.51,68.5 8.61,68.5
bKeepout: area 0,0 to 3.2,76.8
tRestrict: area 4.8,2 to 12.4,9.6; area 4.8,64.7 to 12.4,72.3; area 50.7,2 to 58.3,9.6; area 50.7,64.7 to 58.3,72.3
bRestrict: area 4.8,2 to 12.4,9.6; area 4.8,64.7 to 12.4,72.3; area 50.7,64.7 to 58.3,72.3; area 50.7,2 to 58.3,9.6

### Footprints (pad centres in the part's own frame; a part is rotated, then mirrored left to right if it is on the bottom)
SMD_0603 = smd 1.1 x 1: 1 -0.85,0; 2 0.85,0
SMD_0805 = smd 1.3 x 1.5: 1 -0.95,0; 2 0.95,0
CAP_S0805 = smd 1.3 x 1.5: + -0.95,0; - 0.95,0
CAP_S1210 = smd 1.6 x 2.7: + -1.4,0; - 1.4,0
CAP_S1206 = smd 1.6 x 1.8: + -1.4,0; - 1.4,0
DIODE_DO214-AA = smd 2.032 x 2.184: A -2.286,0; K 2.286,0
SOT143 = smd 1.2 x 1.44: 1 -0.75,-1.1 | smd 1 x 1.44: 2 0.95,-1.1; 3 0.95,1.1; 4 -0.95,1.1
DF3X-4P-2DSA = drill 0.8 square: 1 3,0 | drill 0.8: 2 1,0; 3 -1,0; 4 -3,0
DF13A-20DP-1.25 = smd 0.7 x 1.7: 1 5.625,3; 2 5.625,-3; 3 4.375,3; 4 4.375,-3; 5 3.125,3; 6 3.125,-3; 7 1.875,3; 8 1.875,-3; 9 0.625,3; 10 0.625,-3; 11 -0.625,3; 12 -0.625,-3; 13 -1.875,3; 14 -1.875,-3; 15 -3.125,3; 16 -3.125,-3; 17 -4.375,3; 18 -4.375,-3; 19 -5.625,3; 20 -5.625,-3 | smd 2 x 2.2: A -8.475,0; B 8.475,0
5027020891 = smd 0.8 x 1.16: 1 -2.9,-15.42; 2 -1.8,-15.42; 3 -0.7,-15.42; 4 0.4,-15.42; 5 1.5,-15.42; 6 2.6,-15.42; 7 3.7,-15.42; 8 4.8,-15.42 | smd 1.05 x 1.25: DC 6.885,-13.675; DT 6.885,-4.55 | smd 1 x 2.5: SHDL@3 -7.3,-2.5 | smd 2 x 1.16: SHLD@1 -6.01,-15.42 | smd 1.6 x 1.16: SHLD@2 6.24,-15.42 | smd 1 x 2.2: SHLD@4 7.3,-2.35
534206-5 = drill 0.9 square: 1 5.08,-1.27 | drill 0.9 octagon: 2 5.08,1.27; 3 2.54,-1.27; 4 2.54,1.27; 5 0,-1.27; 6 0,1.27; 7 -2.54,-1.27; 8 -2.54,1.27; 9 -5.08,-1.27; 10 -5.08,1.27
7498011122R = smd 0.71 x 2.5: P1 -3.57,-21.9; P2 -2.55,-21.9; P3 -1.53,-21.9; P4 -0.51,-21.9; P5 0.51,-21.9; P6 1.53,-21.9; P8 3.57,-21.9; P9 5.61,-21.9; P10 6.63,-21.9; P11 -6.63,-21.9; P12 -5.61,-21.9 | smd 1.4 x 2.54: S1 -8.51,-8.01; S2 8.51,-8.01 | hole 1.4: -3.5,-18.21; 3.5,-18.21
292303-1 = drill 0.914 octagon: 1 13,3.5; 2 13,1; 3 13,-1; 4 13,-3.5 | drill 2.3: SHLD@1 10.28,6.57; SHLD@2 10.28,-6.57
DF13A-10DP-1.25 = smd 0.7 x 1.7: 1 2.5,3; 2 2.5,-3; 3 1.25,3; 4 1.25,-3; 5 0,3; 6 0,-3; 7 -1.25,3; 8 -1.25,-3; 9 -2.5,3; 10 -2.5,-3 | smd 2 x 2.2: A -5.35,0; B 5.35,0
CUI-PJ-013C = drill 2.5: 1 11.2,0; 2 6.2,0 | drill 1.8: 3 8.7,-2.7
HDR_M_1 = drill 1 square: 1 0,0
IND-10X10 = smd 4 x 3.2: 1 -4.246,0; 2 4.246,0
HC49UP = smd 5.334 x 1.93: 1 -4.826,0; 2 4.826,0
SMD_1206 = smd 1.6 x 1.8: 1 -1.4,0; 2 1.4,0
WIRE_SMT_150X75 = smd 3.81 x 1.905: 1 0,0
TP_050 = smd 1.27 x 1.27: 1 0,0
SOIC8 = smd 0.6 x 2.2: 1 -1.905,-2.667; 2 -0.635,-2.667; 3 0.635,-2.667; 4 1.905,-2.667; 5 1.905,2.667; 6 0.635,2.667; 7 -0.635,2.667; 8 -1.905,2.667
ARIA_G25 = smd 3 x 0.8: E1 19.05,14.605; E2 19.05,13.335; E3 19.05,12.065; E4 19.05,10.795; E5 19.05,9.525; E6 19.05,8.255; E7 19.05,6.985; E8 19.05,5.715; E9 19.05,4.445; E10 19.05,3.175; E11 19.05,1.905; E12 19.05,0.635; E13 19.05,-0.635; E14 19.05,-1.905; E15 19.05,-3.175; E16 19.05,-4.445; E17 19.05,-5.715; E18 19.05,-6.985; E19 19.05,-8.255; E20 19.05,-9.525; E21 19.05,-10.795; E22 19.05,-12.065; E23 19.05,-13.335; E24 19.05,-14.605; W1 -19.05,-14.605; W2 -19.05,-13.335; W3 -19.05,-12.065; W4 -19.05,-10.795; W5 -19.05,-9.525; W6 -19.05,-8.255; W7 -19.05,-6.985; W8 -19.05,-5.715; W9 -19.05,-4.445; W10 -19.05,-3.175; W11 -19.05,-1.905; W12 -19.05,-0.635; W13 -19.05,0.635; W14 -19.05,1.905; W15 -19.05,3.175; W16 -19.05,4.445; W17 -19.05,5.715; W18 -19.05,6.985; W19 -19.05,8.255; W20 -19.05,9.525; W21 -19.05,10.795; W22 -19.05,12.065; W23 -19.05,13.335; W24 -19.05,14.605 | drill 2.2 pad 3.81 square: GND@1 -17.8,17.8; GND@2 17.8,17.8; GND@3 17.8,-17.8; GND@4 -17.8,-17.8 | smd 0.8 x 3: N1 -14.605,19.05; N2 -13.335,19.05; N3 -12.065,19.05; N4 -10.795,19.05; N5 -9.525,19.05; N6 -8.255,19.05; N7 -6.985,19.05; N8 -5.715,19.05; N9 -4.445,19.05; N10 -3.175,19.05; N11 -1.905,19.05; N12 -0.635,19.05; N13 0.635,19.05; N14 1.905,19.05; N15 3.175,19.05; N16 4.445,19.05; N17 5.715,19.05; N18 6.985,19.05; N19 8.255,19.05; N20 9.525,19.05; N21 10.795,19.05; N22 12.065,19.05; N23 13.335,19.05; N24 14.605,19.05; S1 14.605,-19.05; S2 13.335,-19.05; S3 12.065,-19.05; S4 10.795,-19.05; S5 9.525,-19.05; S6 8.255,-19.05; S7 6.985,-19.05; S8 5.715,-19.05; S9 4.445,-19.05; S10 3.175,-19.05; S11 1.905,-19.05; S12 0.635,-19.05; S13 -0.635,-19.05; S14 -1.905,-19.05; S15 -3.175,-19.05; S16 -4.445,-19.05; S17 -5.715,-19.05; S18 -6.985,-19.05; S19 -8.255,-19.05; S20 -9.525,-19.05; S21 -10.795,-19.05; S22 -12.065,-19.05; S23 -13.335,-19.05; S24 -14.605,-19.05
SSOP28 = smd 0.34 x 1.6: 1 -4.225,-3.85; 2 -3.575,-3.85; 3 -2.925,-3.85; 4 -2.275,-3.85; 5 -1.625,-3.85; 6 -0.975,-3.85; 7 -0.325,-3.85; 8 0.325,-3.85; 9 0.975,-3.85; 10 1.625,-3.85; 11 2.275,-3.85; 12 2.925,-3.85; 13 3.575,-3.85; 14 4.225,-3.85; 15 4.225,3.85; 16 3.575,3.85; 17 2.925,3.85; 18 2.275,3.85; 19 1.625,3.85; 20 0.975,3.85; 21 0.325,3.85; 22 -0.325,3.85; 23 -0.975,3.85; 24 -1.625,3.85; 25 -2.275,3.85; 26 -2.925,3.85; 27 -3.575,3.85; 28 -4.225,3.85
PPSOP8 = smd 0.4 x 1.6: 1 -0.975,-2.2; 2 -0.325,-2.2; 3 0.325,-2.2; 4 0.975,-2.2; 5 0.975,2.2; 6 0.325,2.2; 7 -0.325,2.2; 8 -0.975,2.2 | smd 1.89 x 1.57: T 0,0
SOIC8-EP = smd 0.6 x 2.2: 1 -1.905,-2.667; 2 -0.635,-2.667; 3 0.635,-2.667; 4 1.905,-2.667; 5 1.905,2.667; 6 0.635,2.667; 7 -0.635,2.667; 8 -1.905,2.667 | smd 2.4 x 2.1: EP 0,0
MSOP8 = smd 0.4 x 1.45: 1 -0.975,-2.3; 2 -0.325,-2.3; 3 0.325,-2.3; 4 0.975,-2.3; 5 0.975,2.3; 6 0.325,2.3; 7 -0.325,2.3; 8 -0.975,2.3

### Placement (x,y rotation side)
C1  61.59,62.23 90 top
C2  59.69,61.59 90 top
C3  63.5,62.23 90 top
C4  6.99,28.89 180 top
C5  14.61,28.89 0 top
C6  18.41,13.34 0 top
C7  19.05,15.24 0 top
C8  18.41,11.43 0 top
C9  30.48,2.54 270 top
C10  32.38,2.54 270 top
C11  3.17,11.43 180 top
C12  3.81,17.78 180 top
C13  19.05,3.17 270 top
C14  22.86,6.35 180 top
C15  19.05,50.8 0 top
C16  19.68,8.26 90 top
C17  24.13,1.91 90 top
C20  27.3,68.58 180 bottom
C21  13.97,41.91 90 bottom
C22  19.05,34.29 0 top
C23  13.34,34.92 0 top
C24  13.97,57.78 90 bottom
C25  13.34,51.44 0 top
C29  2.54,15.24 180 top
C30  13.34,32.38 0 top
C31  13.34,48.9 0 top
C32  38.73,10.79 0 top
C33  38.73,1.91 0 top
C34  69.85,45.4 0 top
D1  12.7,41.27 90 top
D2  12.7,57.78 90 top
DA1  67.31,62.87 270 top
J1  71.75,27.94 90 top
J2  67.94,10.16 90 top
J3  73.66,41.91 90 bottom
J4  22.86,64.77 0 top
J5  38.1,81.92 0 top
J6  66.4,79.98 265 top
J7  43.81,6.35 0 top
J8  17.53,80.47 273 top
J9  1.27,30.48 0 top
J10  1.27,66.04 0 top
J11  19.68,28.57 0 top
L1  62.87,59.05 0 top
L2  5.08,55.88 270 top
L3  5.08,39.37 270 top
L6  36.2,2.54 270 top
L7  36.2,10.16 90 top
Q1  10.79,24.77 0 top
R1  25.4,22.23 0 bottom
R2  25.4,24.13 0 bottom
R3  44.45,43.81 180 bottom
R4  44.45,45.72 180 bottom
R5  46.99,53.34 270 bottom
R6  43.81,50.16 0 bottom
R7  45.09,53.34 270 bottom
R8  43.18,53.34 270 bottom
R13  10.79,28.89 0 top
R14  3.81,20 0 top
R15  25.4,26.04 0 bottom
R16  67.94,38.73 270 top
R17  6.99,17.14 270 bottom
R18  26.04,6.99 270 top
R19  21.59,1.91 90 top
R20  26.04,1.91 90 top
R21  22.86,8.26 180 top
R29  27.94,6.99 270 top
R30  27.94,1.91 90 top
TP1  38.1,22.23 180 bottom
TP2  38.1,26.67 180 bottom
TP3  19.68,46.04 0 top
TP4  17.14,46.04 0 top
TP5  23.5,59.05 0 top
TP6  21.59,57.15 0 top
TP7  2.54,9.53 0 top
TP8  20.32,20.95 0 top
TP9  67.94,34.92 0 top
U1  52.7,59.05 270 top
U2  43.18,34.29 270 top
U3  10.79,15.88 270 top
U4  32.38,6.35 270 top
U5  17.78,41.27 0 top
U6  17.78,57.78 0 top
U8  69.22,42.55 270 top
U9  67.94,50.8 0 top
U$1  [OPENHW_LOGO_200]  23.88,72.9 0 top
U$2  [INFO_DATE]  71.75,1.27 0 bottom
U$3  [INFO_COMPACT]  66.04,54.61 0 bottom
U$4  [LOGO2]  2.41,72.01 0 top
U$6  [INFO_AUTHOR]  14.15,2.67 90 top
W1  19.05,13.34 0 bottom
W2  28.57,32.38 90 bottom
W3  31.75,32.38 90 bottom
W4  34.92,32.38 270 bottom

### Tracks (layer width: path | path; a pad name or v marks a point on that pad's centre or on a via)
3.3V  (via drill 0.51, 0.51 pad 1.27)
  Top 0.406: U2.N1 64.14,48.9 66.04,50.8 66.97,50.8 | 66.97,50.8 68.27,50.8 | 68.27,50.8 69.22,50.8 70.7,49.31 C34.2 70.7,44.66 70.31,44.28 U8.4 70.48,43.49 | U9.8 66.97,50.8 | U9.7 67.62,52.08 67.94,51.75 68.27,51.75 | U9.6 68.27,51.75 | U9.5 68.92,52.09 68.58,51.75 68.27,51.75 | 68.27,51.75 68.27,50.8
  Top 0.61: U6.5 20.19,60.45 v21.59,59.05 TP5.1 25.4,60.96 J4.3
  Top 0.813: v55.24,48.9 v56.52,48.9 57.78,48.9 | 28.57,19.68 U2.E24 | U2.S1 28.57,19.68 | 28.57,19.68 v30.48,21.59 | 57.78,48.9 U2.W24 | U2.N1 57.78,48.9
  Power 0.61: v21.59,59.05 21.59,56.52 20.32,55.24 16.51,55.24 14.61,53.34 14.61,51.44
  Power 1.27: 5.08,51.44 2.54,51.44 1.27,50.16 1.27,33.66 5.08,29.84 17.14,29.84 17.78,30.48 24.13,30.48
  Bottom 0.406: R3.1 v41.91,43.81 41.91,45.09 42.55,45.72 R4.1
  Bottom 0.813: J3.4 56.6,42.31 v56.52,42.23
  other vias: 7.62,52.7 62.23,11.43 63.5,11.43 7.62,51.44 7.62,50.16 8.89,52.07 8.89,50.8 60.96,11.43 41.27,50.16
  pour Top (isolate 0.406): 1.91,48.9 1.91,54.29 7.94,54.29 10.16,52.07 12.7,52.07 12.7,48.9
  pour Top (isolate 0.406): 60.01,12.06 65.41,12.06 65.41,10.48 60.01,10.48
  pour Power (isolate 0.406): 3.81,48.9 3.81,54.29 7.94,54.29 9.53,52.7 15.24,52.7 15.24,49.53 8.89,49.53 8.26,48.9
  pour Power (isolate 0.61, rank 2): 23.5,23.5 23.5,31.75 25.4,31.75 29.21,35.56 29.21,47.62 34.29,52.7 41.27,52.7 43.81,55.24 65.41,55.24 69.22,51.44 69.22,38.1 66.04,34.92 66.04,0 52.07,0 52.07,15.24 31.75,15.24
  pour Bottom (isolate 0.61): 40.64,48.26 40.64,52.07 41.27,52.7 48.9,52.7 48.9,48.26
5V  (via drill 0.51, 0.51 pad 1.14)
  Top 0.61: v57.78,58.42 v57.78,59.69 U1.7 | v21.59,43.18 20.83,43.94 U5.5 TP3.1
  Power 0.61: v21.59,43.18 21.59,40.01 20.32,38.73 16.51,38.73 14.61,36.83 14.61,34.92
  Power 1.27: 14.61,34.29 24.13,34.29 26.67,36.83 26.67,48.9 33.02,55.24 40.01,55.24 42.55,57.78 57.78,57.78 | 57.78,57.78 66.67,57.78 71.75,52.7 71.75,36.2 69.22,33.66 69.22,23.5 70.48,22.23 70.48,19.68 | v57.78,58.42 57.78,57.78
  Bottom 1.016: R17.1 3.68,18.55 1.91,20.32 1.91,26.67 v8.26,33.02 v8.26,34.29 v8.26,35.56
  other vias: 72.39,19.05 72.39,16.51 72.39,17.78
  pour Top (isolate 0.406): 1.91,37.78 7.94,37.78 10.16,35.56 12.7,35.56 12.7,32.38 1.91,32.38
  pour Power (isolate 0.406): 3.81,37.78 7.94,37.78 10.16,35.56 15.24,35.56 15.24,32.38 5.08,32.38 3.81,33.66
  pour Power (isolate 0.61): 55.88,57.78 55.88,60.33 59.69,60.33 59.69,57.78
  pour Power (isolate 0.813): 68.58,20.32 73.66,20.32 73.66,0 68.58,0
  pour Top (isolate 0.61): 73.66,13.97 70.48,13.97 70.48,19.68 73.66,19.68
5V_AUD  (via drill 0.51)
  Top 0.406: v33.97,4.13 33.34,3.49 C10.+ 30.48,3.49 C9.1 | U4.6 35.87,6.03 v36.2,6.35
  Top 0.61: J7.8 42.56,1.93 v41.91,1.27
  other vias: 5.08,14.92 3.17,13.65 4.45,13.65
  pour Top (isolate 0.305): 2.54,15.56 6.35,15.56 6.35,13.65 5.08,13.65 4.45,13.02 2.54,13.02
  pour Power (isolate 0.61): 49.53,0 0,0 0,21.59 19.68,21.59 22.23,19.05 22.23,12.06 49.53,12.06
  pour Bottom (isolate 0.61): 2.54,12.7 2.54,15.24 5.08,15.24 5.71,15.88 5.71,16.51 7.62,16.51 7.62,13.65 6.03,13.65 5.08,12.7
9V  (via drill 0.51 pad 1.27)
  Top 0.61: v18.41,36.83 U5.3 | v17.14,53.34 U6.2 U6.3 v18.41,53.34 | U5.2 v17.14,36.83
  Top 0.813: C15.+ 17.65,53.34 v17.14,53.34 | C22.+ 17.65,36.83 v17.14,36.83
  Top 1.016: v18.41,36.83 v17.14,36.83 | v17.14,53.34 v18.41,53.34
  Power 1.27: v17.14,36.83 22.86,36.83 24.13,38.1 24.13,45.72 22.23,47.62 22.23,53.34 | v17.14,53.34 v18.41,53.34 22.23,53.34 | 22.23,53.34 24.13,55.24 24.13,59.69 22.86,60.96 18.41,60.96 17.78,61.59 J4.9 J4.10
  pour Power (isolate 0.61, no thermals): 16.83,62.87 16.83,66.36 17.14,66.67 18.41,66.67 18.73,66.36 18.73,62.87 18.41,62.55 17.14,62.55
BST_3.3V  (via drill 0.51)
  Bottom 1.016: v14.61,55.24 13.97,55.88 C24.1
  pour Top (isolate 0.406, no thermals): 15.88,54.61 15.88,55.88 13.97,55.88 13.97,54.61
BST_5V  (via drill 0.51)
  Bottom 1.016: C21.1 13.97,40.01 v14.61,39.37
  pour Top (isolate 0.406, no thermals): 15.88,38.1 15.88,39.37 13.97,39.37 13.97,38.1
DAC_SHDN  (via drill 0.51)
  Top 0.254: U4.1 30.18,8.6 30.48,8.89 v31.75,8.89 | J7.4 45.06,1.93 v45.72,1.27 | v29.21,12.7 23.5,12.7 22.86,13.34 22.86,17.78 21.19,19.45 20.32,19.45 | TP8.1 20.32,19.45 | 20.32,19.45 U3.27
  Bottom 0.254: 31.75,12.7 39.37,12.7 45.72,6.35 v45.72,1.27 | v31.75,8.89 31.75,12.7 | 31.75,12.7 v29.21,12.7
DAC_VDD  (via drill 0.51)
  Top 0.254: U3.4 6.08,18.15 5.71,17.78 C12.1 4.66,18.52 4.45,18.73 3.17,18.73 2.96,18.95 R14.1
  Bottom 0.254: v8.89,18.41 10.16,19.68 16.19,19.68 22.54,26.04 R15.2
  pour Top (isolate 0.305): 6.99,15.24 6.99,18.41 7.62,18.41 8.26,19.05 14.61,19.05 14.61,15.24
DOUT  (via drill 0.51)
  Top 0.254: J7.1 46.31,10.84 v45.72,11.43 | U3.5 11.07,17.5 v12.06,16.51
  Bottom 0.254: v12.06,16.51 12.38,16.83 17.46,16.83 20.95,20.32 30.48,20.32 34.92,15.88 41.27,15.88 v45.72,11.43
DRX  (via drill 0.51)
  Top 0.254: U2.S14 v28.57,36.2
  Bottom 0.254: v28.57,36.2 W2.1
DTX  (via drill 0.51)
  Top 0.254: U2.S13 30.48,34.92 v31.75,36.2
  Bottom 0.254: v31.75,36.2 W3.1
EARTH  (via drill 0.51)  (2 unrouted)
  Top 0.406: J5.S1 28.57,73.91 v28.57,71.75 | J5.S2 47.62,73.91 v47.62,70.48
  other vias: 68.58,69.85 68.58,72.39 62.23,73.03 62.23,70.48 47.62,71.75 28.57,70.48 47.62,65.41
  pour Top (isolate 0.406): 46.35,64.77 46.35,76.2 73.66,76.2 73.66,66.67 70.87,66.67 68.33,69.22 57.15,69.22 57.15,66.67 55.24,64.77
  pour Bottom (isolate 0.406): 29.21,64.77 29.21,66.67 27.94,66.67 27.94,76.2 29.84,76.2 29.84,67.94 46.35,67.94 46.35,76.2 73.66,76.2 73.66,34.29 70.48,34.29 70.48,67.06 68.33,69.22 56.52,69.22 56.52,64.77
  pour Top: 27.94,67.94 27.94,76.2 29.84,76.2 29.84,67.94
ETH_3V3
  Top 0.254: 38.61,62.1 38.73,62.23
  Top 0.406: J5.P2 35.55,61.59 36.2,62.23 38.73,62.23 40.01,62.23 40.64,61.59 40.64,57.15 40.01,56.52 36.2,56.52 34.92,55.24 U2.W6 | J5.P5 38.61,62.1
ETH_LINK  (via drill 0.51)
  Top 0.254: U2.W8 37.47,49.53 v36.83,48.9 | v33.02,57.15 31.47,58.7 J5.P11
  Bottom 0.254: v36.83,48.9 35.56,47.62 34.29,47.62 33.02,48.9 v33.02,57.15
ETH_RX+  (via drill 0.51)
  Top 0.254: J5.P4 37.59,58.3 v38.1,57.78 | U2.W2 29.84,50.8 31.75,48.9 v34.92,48.9
  Bottom 0.254: v38.1,57.78 34.92,54.61 v34.92,48.9
ETH_RX-  (via drill 0.51)
  Top 0.254: J5.P6 39.63,58.05 v39.37,57.78 | U2.W3 31.11,50.8 31.75,50.16 v36.2,50.16
  Bottom 0.254: v39.37,57.78 36.2,54.61 v36.2,50.16
ETH_TRF
  Top 0.254: U2.W7 36.2,55.24 36.83,55.88 41.27,55.88 43.71,58.31 J5.P9
ETH_TX+
  Top 0.254: J5.P1 34.53,57.39 32.38,55.24 U2.W4
ETH_TX-
  Top 0.254: J5.P3 36.57,58.16 33.66,55.24 U2.W5
GND  (via drill 0.51)
  Top 0.305: U3.12 8.89,12.95 | 8.89,12.95 9.53,12.95 v9.53,12.7 | U3.6 5.74,16.85 5.4,16.51 4.13,16.51 | U3.19 12.98,14.25 v12.7,13.97 12.7,13.34 13.09,12.95 U3.17 | U3.11 8.24,13.6 8.89,12.95
  Top 0.406: U4.7 32.38,6.67 U4.T | J7.6 v43.81,1.27 | U9.4 68.92,45.4 C34.1 | v40.96,17.78 41.27,17.46 41.27,15.88
  Top 0.61: U6.7 v17.14,58.42 | v17.14,41.91 U5.7 TP4.1 | v53.34,59.69 53.34,59.05 53.98,58.42 55.24,58.42 | 14.61,53.34 15.88,53.34 15.88,52.7 16.19,52.39 16.19,47.94 | 13.65,36.83 15.88,36.83 15.88,36.2 16.19,35.88 16.19,31.75 | 65.47,64.35 DA1.1
  Bottom 0.406: J3.6 58.24,44.45 v56.52,44.45
  Bottom 0.61: v41.27,26.67 TP2.1 | W4.1 v34.92,36.2
  other vias: 62.87,66.04 61.59,65.41 55.88,62.87 60.33,66.04 28.57,11.43 44.45,62.23 33.66,62.23 33.02,10.16 26.67,11.43 21.59,15.88 1.27,16.51 30.48,11.43 1.27,17.78 12.7,12.06 10.79,10.16 21.59,14.61 24.77,10.16 3.81,7.62 3.81,3.17 6.99,10.16 6.99,21.59 24.13,4.45 25.4,4.45 26.67,4.45 22.86,3.81 22.86,2.54 15.88,5.08 29.21,3.81 31.75,6.99 33.02,6.99 33.02,5.71 31.75,5.71 21.59,12.06 9.53,40.64 10.79,55.24 18.41,58.42 18.41,57.15 17.14,57.15 18.41,41.91 17.14,40.64 18.41,40.64 15.88,40.64 20.32,48.26 15.88,57.15 34.29,2.54 29.21,2.54 34.92,8.89 34.92,10.16 8.26,21.59 10.79,13.97 62.87,13.34 61.59,13.34 49.53,62.87 53.34,60.96 52.07,60.96 52.07,59.69 31.11,46.35 60.33,13.34 26.67,55.88 26.67,54.61 36.2,38.1 46.35,42.55 66.67,44.13 36.2,46.35 27.94,55.88 10.79,40.01 10.79,56.52 10.79,57.78 24.77,11.43 31.11,38.1 66.67,42.86 16.51,48.26 10.79,41.27 19.68,57.15 19.68,40.64 19.68,32.07 18.41,32.07 17.14,32.07 13.34,7.62 17.14,7.62 15.24,9.53 13.34,21.59 14.61,21.59 42.55,62.23 31.75,62.23 9.53,57.15 9.53,55.88 10.79,38.73 9.53,39.37 19.68,41.91 15.88,41.91 19.68,58.42 15.88,58.42 58.42,26.04 37.47,17.78 10.79,53.98 9.53,54.61 10.79,37.47 9.53,38.1 20.95,32.07 17.78,48.26 19.05,48.26 1.27,13.97 1.27,12.7 3.17,47.62 5.08,47.62 6.99,47.62 8.89,47.62 3.17,64.14 5.08,64.14 11.43,64.14 13.34,64.14 5.71,21.59 15.88,21.59 67.63,45.09 62.87,64.77 60.33,64.77
  pour Top (isolate 0.406): 29.84,59.05 29.84,63.5 57.15,63.5 59.05,65.41 59.05,67.94 63.5,67.94 63.5,66.04 67.31,66.04 67.31,56.52 48.9,56.52 48.9,59.05
  pour Top (isolate 0.406, rank 6): 23.5,13.97 23.5,57.78 28.57,57.78 28.57,53.98 59.05,53.98 59.05,55.24 64.77,55.24 64.77,48.9 62.87,48.9 62.87,17.78 64.77,17.78 64.77,12.7 57.78,12.7 57.78,13.97
  pour Top (isolate 0.406, rank 3): 8.26,48.9 8.26,59.69 21.59,59.69 21.59,48.9 20.32,47.62 15.24,47.62 13.97,48.9
  pour Top (isolate 0.406, rank 3): 8.26,33.02 8.26,43.5 19.68,43.5 19.68,42.55 21.59,42.55 21.59,31.43 14.92,31.43 13.34,33.02
  pour Top (isolate 0.406): 16.51,30.48 5.08,30.48 1.91,27.3 1.91,22.86 3.81,20.95 17.78,20.95 19.68,22.86 19.68,27.3
  pour GND (isolate 0.61): 0,76.83 73.66,76.83 73.66,0 0,0
  pour Bottom (isolate 0.61): 0,29.84 21.59,29.84 24.13,32.38 24.13,46.99 22.23,48.9 22.23,57.15 24.13,59.05 24.13,67.31 26.67,67.31 26.67,76.83 0,76.83
  pour Bottom (isolate 0.61, rank 5): 0,0 49.53,0 49.53,12.06 22.23,12.06 22.23,22.23 0,22.23
  pour Top (isolate 0.406, rank 3): 49.53,0 49.53,12.38 22.23,12.38 22.23,19.05 0,19.05 0,0
  pour Top (isolate 0.406): 68.9,42.23 66.04,42.23 66.04,47.62 68.9,47.62
  pour GND (isolate 0.406, no thermals): 21.91,67.31 23.81,67.31 23.81,62.23 21.91,62.23
  pour Bottom (isolate 0.406, no thermals): 21.91,67.31 23.81,67.31 23.81,62.23 21.91,62.23
HID0  (via drill 0.51)
  Top 0.254: U3.22 16.18,16.2 v16.51,15.88 | J7.5 43.81,10.79 v43.18,11.43
  Bottom 0.254: v16.51,15.88 19.05,15.88 22.23,19.05 29.21,19.05 33.66,14.61 40.01,14.61 v43.18,11.43
HID1  (via drill 0.51)
  Top 0.254: U3.23 20.02,16.85 20.32,17.14 v21.59,17.14 | J7.7 42.56,10.78 v41.91,11.43
  Bottom 0.254: v41.91,11.43 39.37,13.97 28.57,13.97 27.94,13.34 23.5,13.34 22.86,13.97 22.86,16.51 22.23,17.14 v21.59,17.14
HID2  (via drill 0.51)
  Top 0.254: U3.24 19.41,17.5 v20.32,18.41 | J7.3 45.06,10.81 v44.45,11.43
  Bottom 0.254: v20.32,18.41 21.59,19.68 29.84,19.68 34.29,15.24 40.64,15.24 v44.45,11.43
MISO  (via drill 0.51)
  Top 0.254: U2.S9 27.3,29.84 29.21,31.75 36.2,31.75 v36.83,32.38 | v72.71,4.13 72.3,4.54 J2.20
  Bottom 0.254: v36.83,32.38 37.47,32.38 44.45,25.4 44.45,15.88 46.99,13.34 53.34,13.34 62.55,4.13 v72.71,4.13
MOSI  (via drill 0.51)
  Top 0.254: U2.S10 27.3,31.11 28.57,32.38 35.56,32.38 36.83,33.66 v37.47,33.66 | v72.71,5.4 72.32,5.79 J2.18
  Bottom 0.254: v37.47,33.66 45.09,26.04 45.09,16.51 47.62,13.97 53.98,13.97 62.55,5.4 v72.71,5.4
N$1  (via drill 0.51)
  Top 0.406: U2.E20 33.66,20.95 v34.92,22.23
  Bottom 0.406: TP1.1 v34.92,22.23
N$2
  cutout GND (isolate 0.61): 0,22.23 19.68,22.23 25.4,27.94 25.4,47.62 23.5,49.53 23.5,56.52 22.23,56.52 22.23,48.9 24.13,46.99 24.13,32.38 21.59,29.84 0,29.84
N$3
  cutout GND (isolate 0.61): 27.3,76.2 27.3,64.14 57.78,64.14 59.05,65.41 59.05,67.94 67.94,67.94 69.85,66.04 69.85,33.66 73.66,33.66 73.66,76.2
N$4
  cutout GND (isolate 0.61): 52.07,0 52.07,15.24 29.21,15.24 27.3,13.34 23.5,13.34 23.5,18.41 22.23,18.41 22.23,12.06 49.53,12.06 49.53,0
N$5
  Top 0.61: C3.1 63.5,59.05 L1.2 69.85,59.05 70.48,59.69 70.48,62.87 69.53,63.81 DA1.4 68.41,64.6 68.75,64.94 J6.1
N$12  (via drill 0.51)
  Top 0.254: U3.9 8.6,14.9 v8.89,14.61
  Bottom 0.254: R2.2 23.5,24.13 22.86,23.5 20.95,23.5 16.51,19.05 10.79,19.05 8.89,17.14 v8.89,14.61
N$13  (via drill 0.51)
  Top 0.254: U3.8 9.52,15.55 v9.84,15.88
  Bottom 0.254: R1.2 23.5,22.23 22.86,22.86 21.27,22.86 16.83,18.41 11.11,18.41 9.53,16.83 9.53,16.19 v9.84,15.88
N$14
  Top 0.254: U3.13 5.63,12.3 4.76,11.43 C11.1
N$15
  Top 0.254: U3.18 16.25,13.6 16.51,13.34 C6.+
N$16
  Top 0.254: U3.20 16.8,14.9 17.14,15.24 C7.1
N$17
  Top 0.254: U3.16 16.27,12.3 17.14,11.43 C8.1
N$18
  Top 0.254: C14.+ 24.13,6.35 25.61,7.83 R18.1 R29.1
N$19
  Top 0.254: U3.3 5.96,18.8 5.71,19.05 5.71,19.68 5.4,20 R14.2
N$20  (via drill 0.51)
  Top 0.254: U3.15 15.65,11.65 15.88,11.43 v15.88,10.79
  Bottom 0.254: v15.88,10.79 15.88,12.7 16.51,13.34 W1.1
N$21
  Top 0.254: R16.1 67.94,41.59 U8.2
N$23
  Bottom 1.27: J8.1 18.98,69.28 20.32,67.94 J4.8 J4.7
N$24
  Top 0.406: L6.1 36.2,5.08 35.9,5.38 U4.5
N$25
  Top 0.406: L7.1 36.2,7.62 35.9,7.33 U4.8
N$26
  Top 0.254: R18.2 R29.2 27.94,6.03 U4.3
N$27
  Top 0.254: R20.2 R30.2 27.94,4.45 28.87,5.38 U4.4
N$28
  Top 0.254: C17.1 R20.1 R30.1
N$29
  Top 0.254: C14.- 21.91,4.76 21.59,4.45 R19.2 20.54,2.75 19.55,1.77 C13.-
N$30
  cutout Top: 3.81,22.23 2.54,23.5 2.54,26.04 4.45,27.94 17.14,27.94 19.05,26.04 19.05,23.5 17.78,22.23
N$31
  Top 0.254: C16.2 21.16,9.11 R21.2
NRST  (via drill 0.51)
  Top 0.254: U2.E21 32.38,22.86 34.92,25.4 42.55,25.4 43.81,26.67 43.81,33.66 46.35,36.2 55.88,36.2 59.05,33.02 v59.05,29.84 | v66.67,32.38 67.94,33.66 TP9.1 R16.2
  Bottom 0.254: v66.67,32.38 64.77,32.38 62.23,29.84 v59.05,29.84
PC18/PWM0  (via drill 0.51)
  Top 0.254: J2.10 72.4,10.79 v72.71,10.48 | U2.N20 64.77,24.77 v66.04,23.5
  Bottom 0.254: v66.04,23.5 67.31,22.23 67.31,13.34 70.17,10.48 v72.71,10.48
PC19/PWM1  (via drill 0.51)
  Top 0.254: v66.04,22.23 64.77,23.5 U2.N21 | J2.12 72.38,9.54 v72.71,9.21
  Bottom 0.254: v66.04,22.23 66.67,21.59 66.67,12.7 70.17,9.21 v72.71,9.21
PC20/PWM2  (via drill 0.51)
  Top 0.254: J2.11 64.94,9.53 v62.87,9.53 | v64.77,22.23 U2.N22
  Bottom 0.254: v62.87,9.53 64.14,9.53 64.77,10.16 v64.77,22.23
PC22/TXD3
  Top 0.254: U2.E2 56.52,12.7 57.15,12.06 58.42,12.06 62.2,8.29 J2.13
PC23/RXD3
  Top 0.254: U2.E3 55.24,12.06 55.88,11.43 57.78,11.43 62.18,7.04 J2.15
PC24/RTS3
  Top 0.254: U2.E4 53.98,12.06 55.24,10.79 57.15,10.79 62.16,5.79 J2.17
PC25/CTS3
  Top 0.254: U2.E5 52.7,12.06 54.61,10.16 56.52,10.16 62.14,4.54 J2.19
SCL0  (via drill 0.51)
  Top 0.254: J2.8 72.42,12.04 v72.71,11.75 | v48.9,45.09 48.9,48.9 50.16,50.16 U2.W18 50.16,54.61 v51.44,55.88 | U9.2 67.62,46.98 65.41,44.77 65.41,35.56 v66.04,34.92 66.04,33.66 65.41,33.02 65.41,27.3 67.31,25.4 v67.31,23.5
  Bottom 0.254: v67.31,23.5 67.94,22.86 67.94,13.97 70.17,11.75 v72.71,11.75 | v66.04,34.92 65.41,35.56 64.77,35.56 62.23,38.1 51.44,38.1 48.26,41.27 48.26,43.18 48.9,43.81 v48.9,45.09 48.26,45.72 R4.2 | v51.44,55.88 51.44,57.15 48.26,60.33 31.75,60.33 30.48,61.59 30.48,64.77 29.21,66.04 J4.2
SD_CLK  (via drill 0.51)
  Top 0.254: v51.44,41.91 49.53,40.01 43.18,40.01 40.01,36.83 40.01,31.75 38.1,29.84 31.11,29.84 27.3,26.04 U2.S6
  Bottom 0.254: J3.5 56.11,43.41 54.61,41.91 v51.44,41.91
SD_CMD  (via drill 0.51)
  Top 0.254: v49.53,41.27 48.9,40.64 42.55,40.64 39.37,37.47 39.37,32.38 37.47,30.48 30.48,30.48 27.3,27.3 U2.S7
  Bottom 0.254: v49.53,41.27 50.16,40.64 52.07,40.64 52.64,41.21 J3.3
SD_DAT0  (via drill 0.51)
  Top 0.254: U2.S8 27.3,28.57 29.84,31.11 36.83,31.11 38.73,33.02 38.73,38.1 41.91,41.27 48.26,41.27 50.8,43.81 v52.7,43.81
  Bottom 0.254: J3.7 55.77,45.61 53.98,43.81 v52.7,43.81
SD_DAT1  (via drill 0.51)
  Top 0.254: U2.S5 27.3,24.77 31.75,29.21 38.73,29.21 40.64,31.11 40.64,36.2 43.81,39.37 50.16,39.37 53.98,43.18 v53.98,45.09
  Bottom 0.254: J3.8 55.6,46.71 v53.98,45.09
SD_DAT2  (via drill 0.51)
  Top 0.254: U2.S4 27.3,23.5 32.38,28.57 39.37,28.57 41.27,30.48 41.27,35.56 44.45,38.73 50.8,38.73 v51.44,39.37
  Bottom 0.254: J3.1 52.43,39.01 52.07,39.37 v51.44,39.37
SD_DAT3  (via drill 0.51)
  Top 0.254: U2.S3 27.3,22.23 33.02,27.94 40.01,27.94 41.91,29.84 41.91,34.92 45.09,38.1 51.44,38.1 v53.34,40.01
  Bottom 0.254: J3.2 58.24,40.01 v53.34,40.01
SDA0  (via drill 0.51)
  Top 0.254: J2.6 72.44,13.29 v72.71,13.02 | v47.62,43.81 47.62,48.9 48.9,50.16 U2.W17 48.9,55.24 v49.53,55.88 | U9.1 66.97,47.28 64.77,45.09 v64.77,34.29 64.77,26.04 v66.04,24.77
  Bottom 0.254: v66.04,24.77 67.31,24.77 68.58,23.5 68.58,14.61 70.17,13.02 v72.71,13.02 | v64.77,34.29 61.59,37.47 50.8,37.47 47.62,40.64 v47.62,43.81 R3.2 | v49.53,55.88 49.53,57.78 47.62,59.69 31.11,59.69 29.84,60.96 29.84,64.14 29.21,64.77 26.67,64.77 J4.4
SPCK  (via drill 0.51)
  Top 0.254: U2.S11 27.3,32.38 27.94,33.02 34.92,33.02 36.83,34.92 v37.47,34.92 | v72.71,6.67 72.34,7.04 J2.16
  Bottom 0.254: v37.47,34.92 45.72,26.67 45.72,17.14 48.26,14.61 54.61,14.61 62.55,6.67 v72.71,6.67
SPI_CS0  (via drill 0.51)
  Top 0.254: U2.S12 34.29,33.66 36.83,36.2 v37.47,36.2 | v72.71,7.94 72.36,8.29 J2.14
  Bottom 0.254: v37.47,36.2 46.35,27.3 46.35,17.78 48.9,15.24 55.24,15.24 62.55,7.94 v72.71,7.94
SPK+
  Top 0.406: L6.2 36.62,1.69 36.83,1.91 C33.1 37.88,2.96 38.27,3.35 J7.10
SPK-
  Top 0.406: J7.9 38.27,9.35 37.88,9.74 C32.1 36.83,10.79 36.62,11.01 L7.2
SW_3.3  (via drill 0.51)
  Bottom 1.016: C24.2 13.97,59.69 v14.61,60.33
  other vias: 7.62,61.59 7.62,60.33 8.89,60.96 7.62,59.05 8.89,59.69
  pour Top (isolate 0.406): 1.91,57.47 1.91,62.87 15.24,62.87 15.88,62.23 15.88,60.33 14.61,59.05 9.53,59.05 7.94,57.47
  pour Power (isolate 0.406): 3.81,57.47 3.81,62.87 15.24,62.87 15.88,62.23 15.88,59.05 9.53,59.05 7.94,57.47
SW_5V  (via drill 0.51)
  Bottom 1.016: C21.2 13.97,43.81 v14.61,44.45
  other vias: 7.62,45.09 7.62,43.81 7.62,42.55 8.89,44.45 8.89,43.18
  pour Top (isolate 0.406): 1.91,40.96 1.91,46.35 15.24,46.35 15.88,45.72 15.88,43.81 14.61,42.55 9.53,42.55 7.94,40.96
  pour Power (isolate 0.406): 3.81,40.96 3.81,46.35 15.24,46.35 15.88,45.72 15.88,43.81 14.61,42.55 9.53,42.55 7.94,40.96
USB_EN1  (via drill 0.51)
  Top 0.254: U1.1 48.26,60.96 43.81,56.52 v43.81,55.88 U2.W13
  Bottom 0.254: v43.81,55.88 43.18,55.24 R8.1
USB_EN2  (via drill 0.51)
  Top 0.254: U1.4 48.9,57.15 47.62,55.88 U2.W16 47.62,50.8 46.99,50.16 v46.35,50.16
  Bottom 0.254: R6.1 v46.35,50.16
USB_FLAG1  (via drill 0.51)
  Top 0.254: U1.2 48.26,59.69 45.09,56.52 v45.09,55.88 U2.W14
  Bottom 0.254: v45.09,55.88 R7.1
USB_FLAG2  (via drill 0.51)
  Top 0.254: U1.3 48.26,58.42 46.35,56.52 v46.35,55.88 U2.W15
  Bottom 0.254: v46.35,55.88 46.99,55.24 R5.1
USBA_5V
  Top 0.61: 61.59,59.05 C1.1 | U1.8 58.42,60.96 58.73,60.65 C2.1 59.69,59.69 60.33,59.05 61.59,59.05 | 61.59,59.05 L1.1
USBA_D+  (via drill 0.51)
  Top 0.254: U2.E19 34.92,17.78 35.24,18.1 35.24,20.95 38.42,24.13 43.5,24.13 45.09,25.72 45.09,33.66 46.35,34.92 54.93,34.92 56.52,33.34 56.52,29.21 57.47,28.26 58.74,28.26 v59.05,28.57 | v69.22,38.73 69.22,33.34 66.99,31.11 v66.67,31.11 | v66.36,60.33 66.36,61.91 DA1.2
  Bottom 0.254: v69.22,38.73 68.26,39.69 68.26,40.64 68.58,40.96 68.58,45.72 66.67,47.62 66.67,60.01 v66.36,60.33 66.67,60.64 66.67,62.23 64.77,64.14 64.77,66.62 J6.3 | v59.05,28.57 59.37,28.26 61.91,28.26 64.45,30.8 66.36,30.8 v66.67,31.11
USBA_D-  (via drill 0.51)
  Top 0.254: v59.05,27.3 58.74,27.62 57.15,27.62 55.88,28.89 55.88,33.02 54.61,34.29 46.67,34.29 45.72,33.34 45.72,25.4 43.81,23.5 38.73,23.5 35.88,20.64 35.88,18.1 36.2,17.78 U2.E18 | v69.22,40.01 70.17,39.05 70.17,38.42 69.85,38.1 69.85,33.02 v66.67,29.84 | v67.63,60.33 68.41,61.11 DA1.3
  Bottom 0.254: v69.22,40.01 69.22,46.04 67.31,47.94 67.31,60.01 v67.63,60.33 67.31,60.64 67.31,62.55 65.41,64.45 65.41,66.09 J6.2 | v59.05,27.3 59.37,27.62 62.23,27.62 64.77,30.16 66.36,30.16 v66.67,29.84
USBB_5V
  Top 0.61: J1.1 71.75,33.02 72.39,33.66 72.39,53.34 68.58,57.15 U1.5
USBB_D+  (via drill 0.51)
  Top 0.254: U2.E16 38.73,17.78 39.05,18.1 39.05,20 40.01,20.95 43.18,20.95 45.09,19.05 55.24,19.05 56.52,20.32 56.52,23.5 57.47,24.45 58.74,24.45 v59.05,24.77
  Bottom 0.254: v59.05,24.77 59.37,24.45 61.28,24.45 65.09,28.26 71.07,28.26 J1.2
USBB_D-  (via drill 0.51)
  Top 0.254: U2.E15 40.01,17.78 39.69,18.1 39.69,19.37 40.64,20.32 42.86,20.32 44.77,18.41 55.56,18.41 57.15,20 57.15,23.18 57.78,23.81 58.74,23.81 v59.05,23.5
  Bottom 0.254: v59.05,23.5 59.37,23.81 61.59,23.81 65.41,27.62 71.07,27.62 J1.3
USBC_D+  (via drill 0.51)
  Top 0.254: U2.E12 43.81,17.78 v42.55,19.05
  Bottom 0.254: v42.55,19.05 42.23,19.05 41.59,19.68 35.24,19.68 31.43,23.5 27.94,23.5 27.3,24.13 R2.1 R15.1
USBC_D-  (via drill 0.51)
  Top 0.254: U2.E13 v42.55,17.78
  Bottom 0.254: v42.55,17.78 41.27,19.05 34.92,19.05 31.11,22.86 27.94,22.86 27.3,22.23 R1.1
V_AUX_ON  (via drill 0.51)
  Top 0.254: v31.75,57.15 30.48,57.15 27.94,59.69 J4.1 | U2.W9 v38.73,50.16
  Bottom 0.254: v38.73,50.16 38.73,49.53 36.2,46.99 33.66,46.99 31.75,48.9 v31.75,57.15
VOUTL  (via drill 0.51)
  Top 0.254: U3.14 5.93,11.65 4.45,10.16 v4.45,9.53 TP7.1 | C13.+ v19.05,6.35 19.05,6.99 19.68,7.62 C16.1
  Bottom 0.254: v4.45,9.53 5.08,9.53 6.99,11.43 11.43,11.43 16.51,6.35 v19.05,6.35
XTI
  Top 0.254: U3.28 12.92,20.1 11.43,21.59 11.43,24.77 | 11.43,24.77 11.43,27.3 11.64,27.52 R13.2 C5.1 | Q1.2 11.43,24.77
XTO
  Top 0.254: U3.1 8.67,20.1 10.16,21.59 10.16,24.77 | 10.16,24.77 10.16,27.3 9.95,27.52 R13.1 C4.1 | Q1.1 10.16,24.77

### Text on the board
tPlace: 3.3V | GND | GND | 5V | BFRIGON.COM
bPlace: DRX | DTX | GND
bNames: DEBUG | - | VBAT | + | A-R
_tsilk: J8 | C19 | L3 | C18 | L5 | C2 | C3 | F1 | J6 | C22 | J5 | U1 | L2 | DA1 | C1 | C24 | J10 | C21 | L1 | D1 | C25 | J9 | U2 | U6 | U5 | R27 | W | R25 | R23 | L4 | C23 | R3 | J2 | R4 | A | CLOCK | PC-03 | Rev. | S | N | C9 | C17 | R20 | R30 | C10 | U4 | R18 | R29 | E | R19 | C13 | C14 | R21 | C16 | R16 | J1 | J7 | R17 | R15 | C8 | Q1 | C7 | C6 | U3 | BFRIGON.COM
_bsilk: C20 | R22 | R11 | R12 | R24 | R26 | R10 | R9 | R5 | R6 | R8 | R7 | U7 | R28 | C26 | R1 | R2 | J3 | J4 | DTX | GND | DRX | VBAT | + | - | D+ | D- | C11 | C12 | R14 | C5 | C4 | R13